# EAGLE board step400_r1 (EAGLE 9.6.2), part 1 of 2
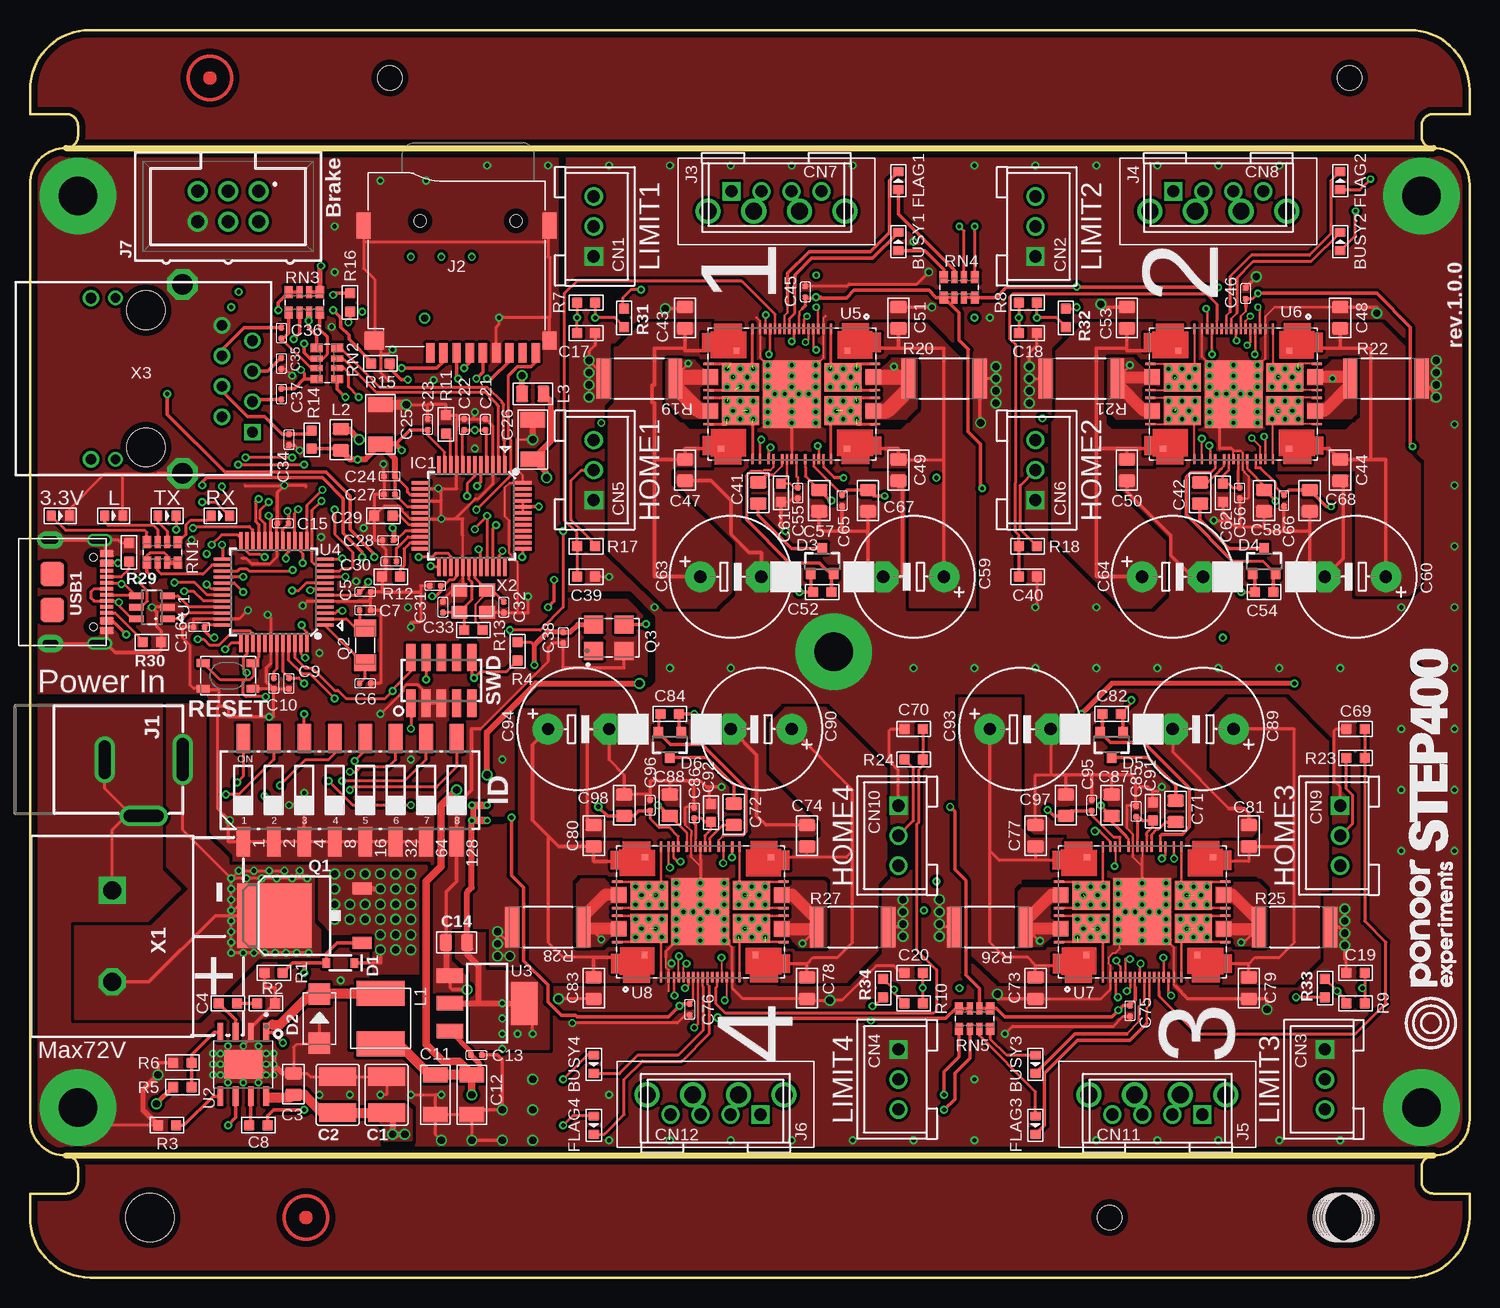
[diagram p3: board, top side]
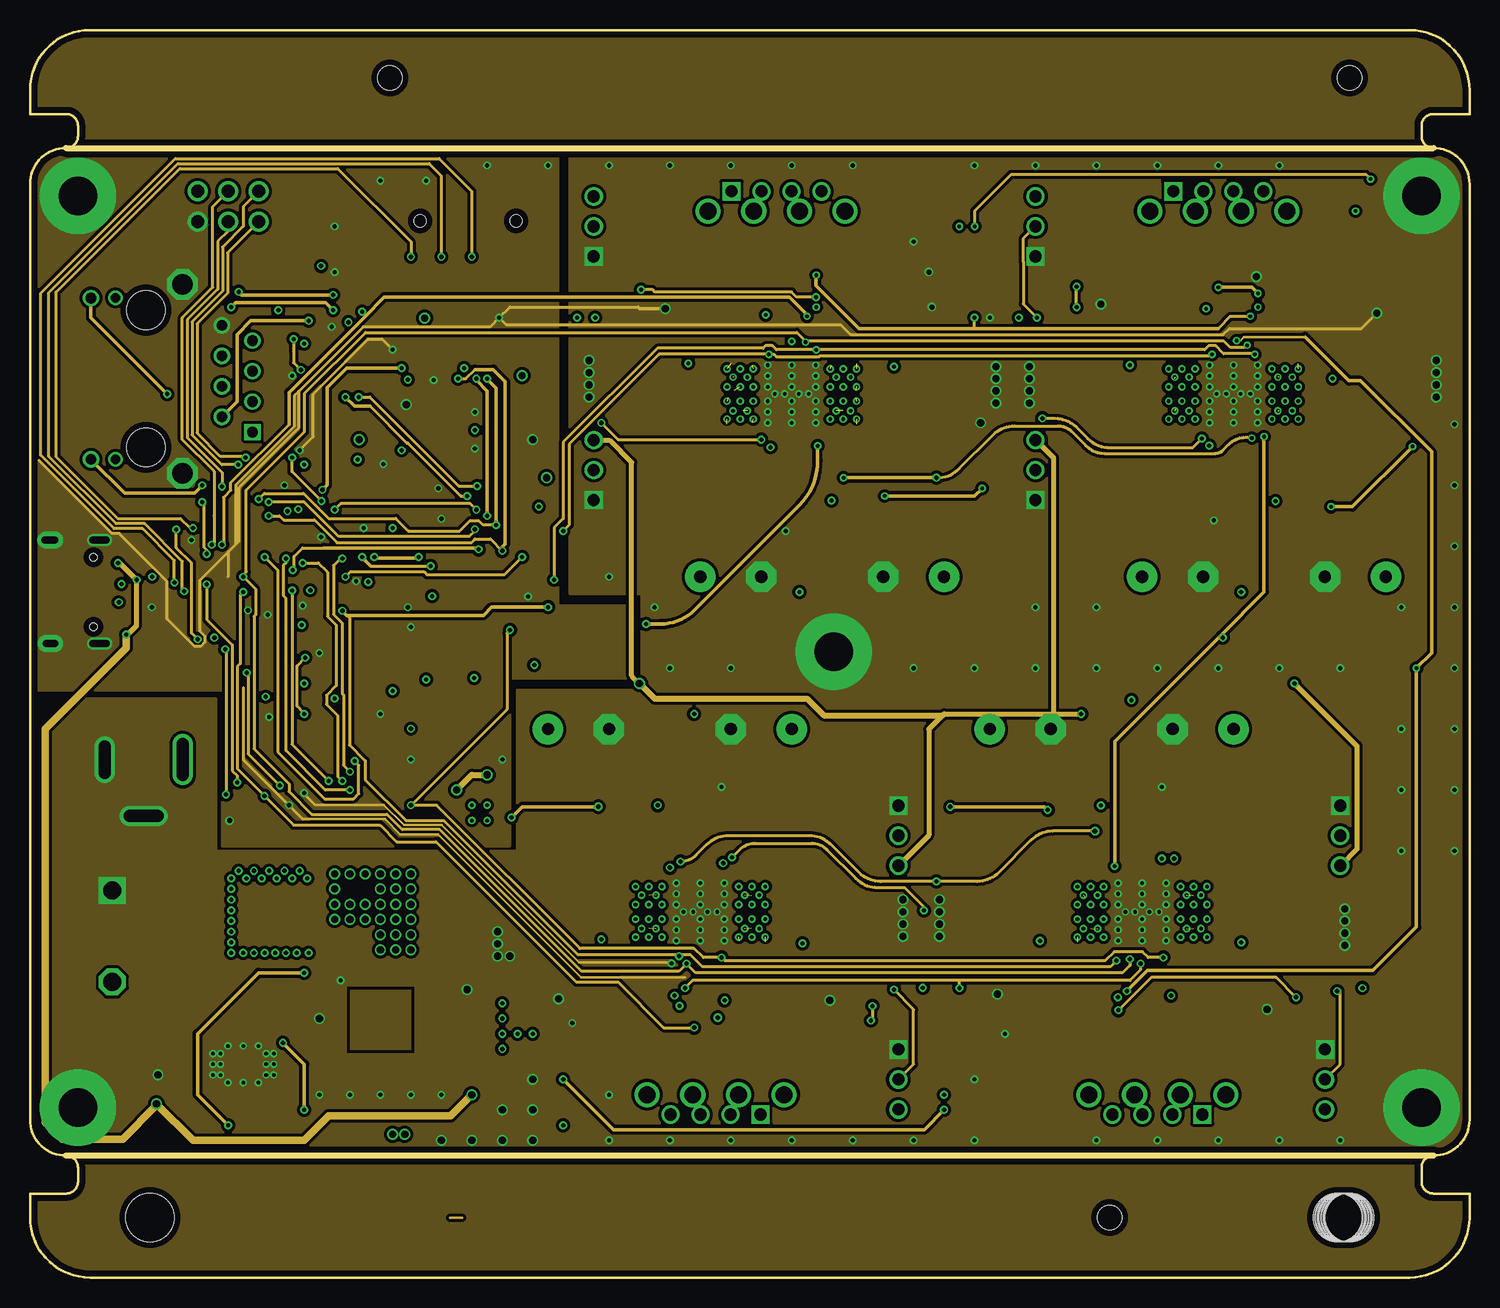
[diagram p4: board, inner layer Route2]
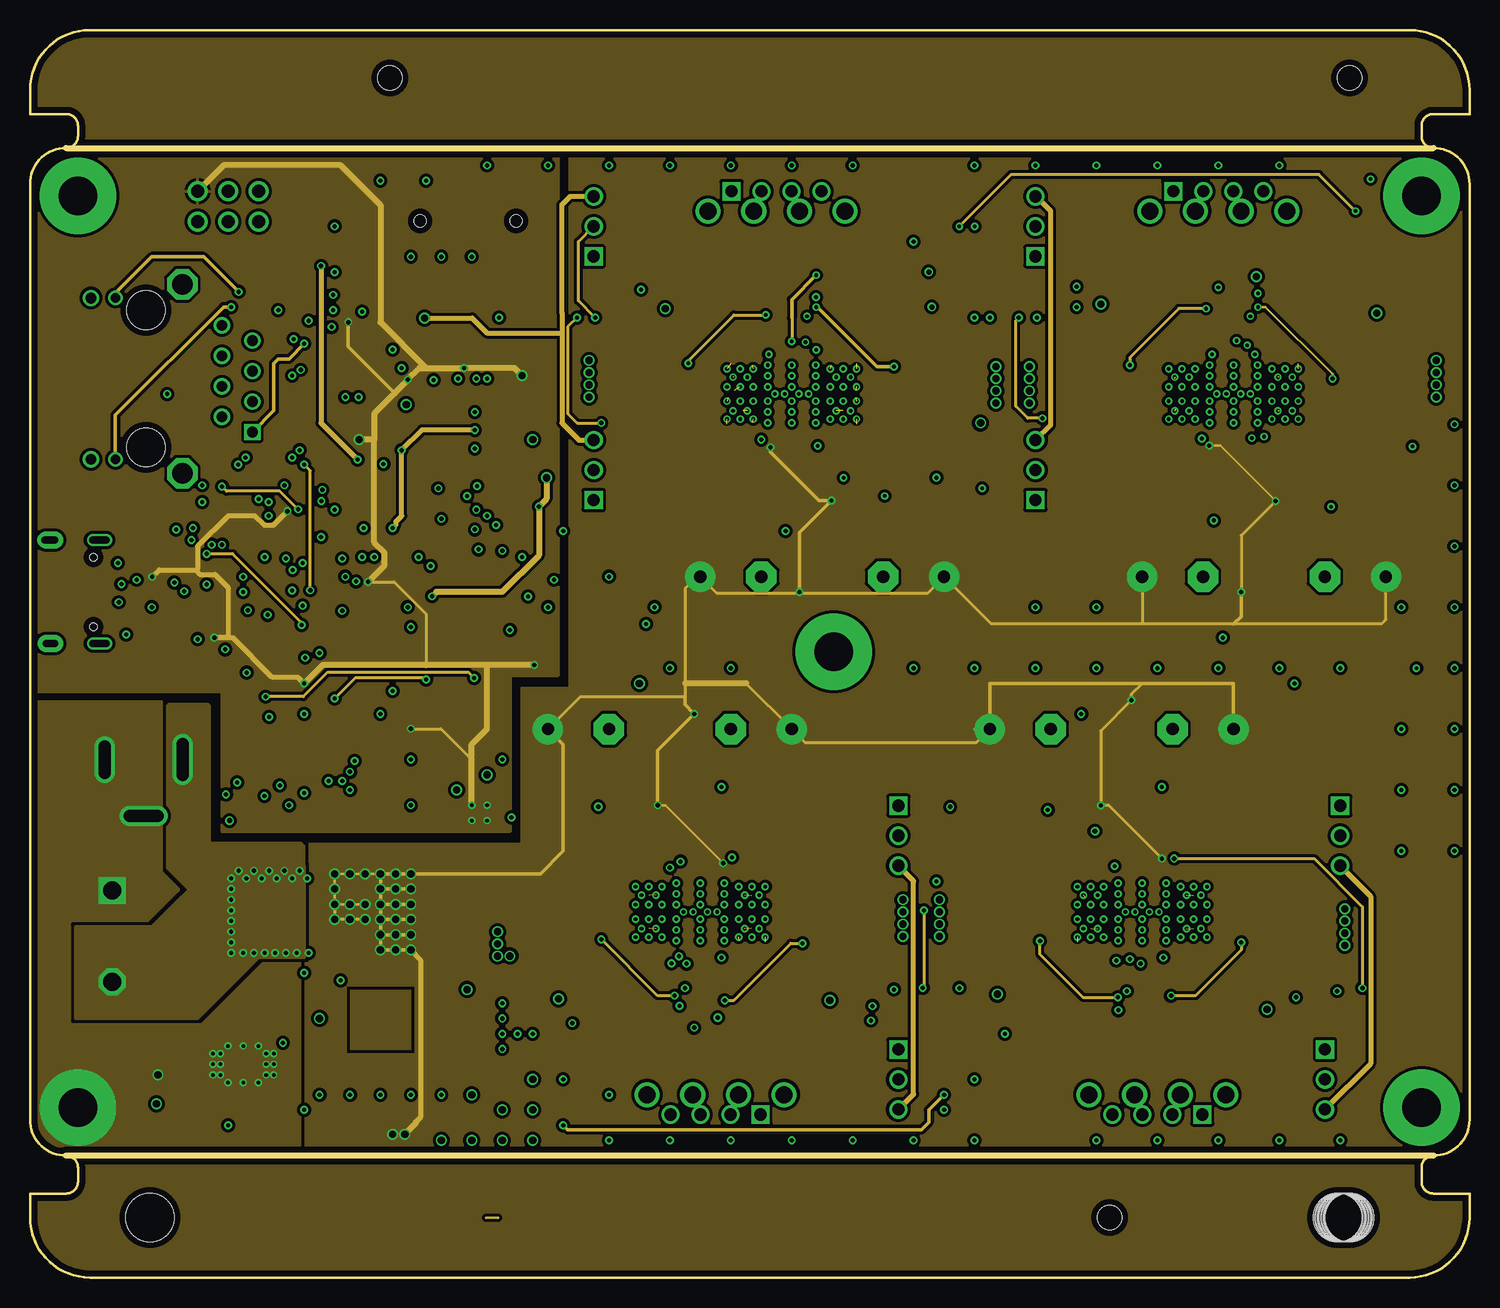
[diagram p5: board, inner layer Route15]
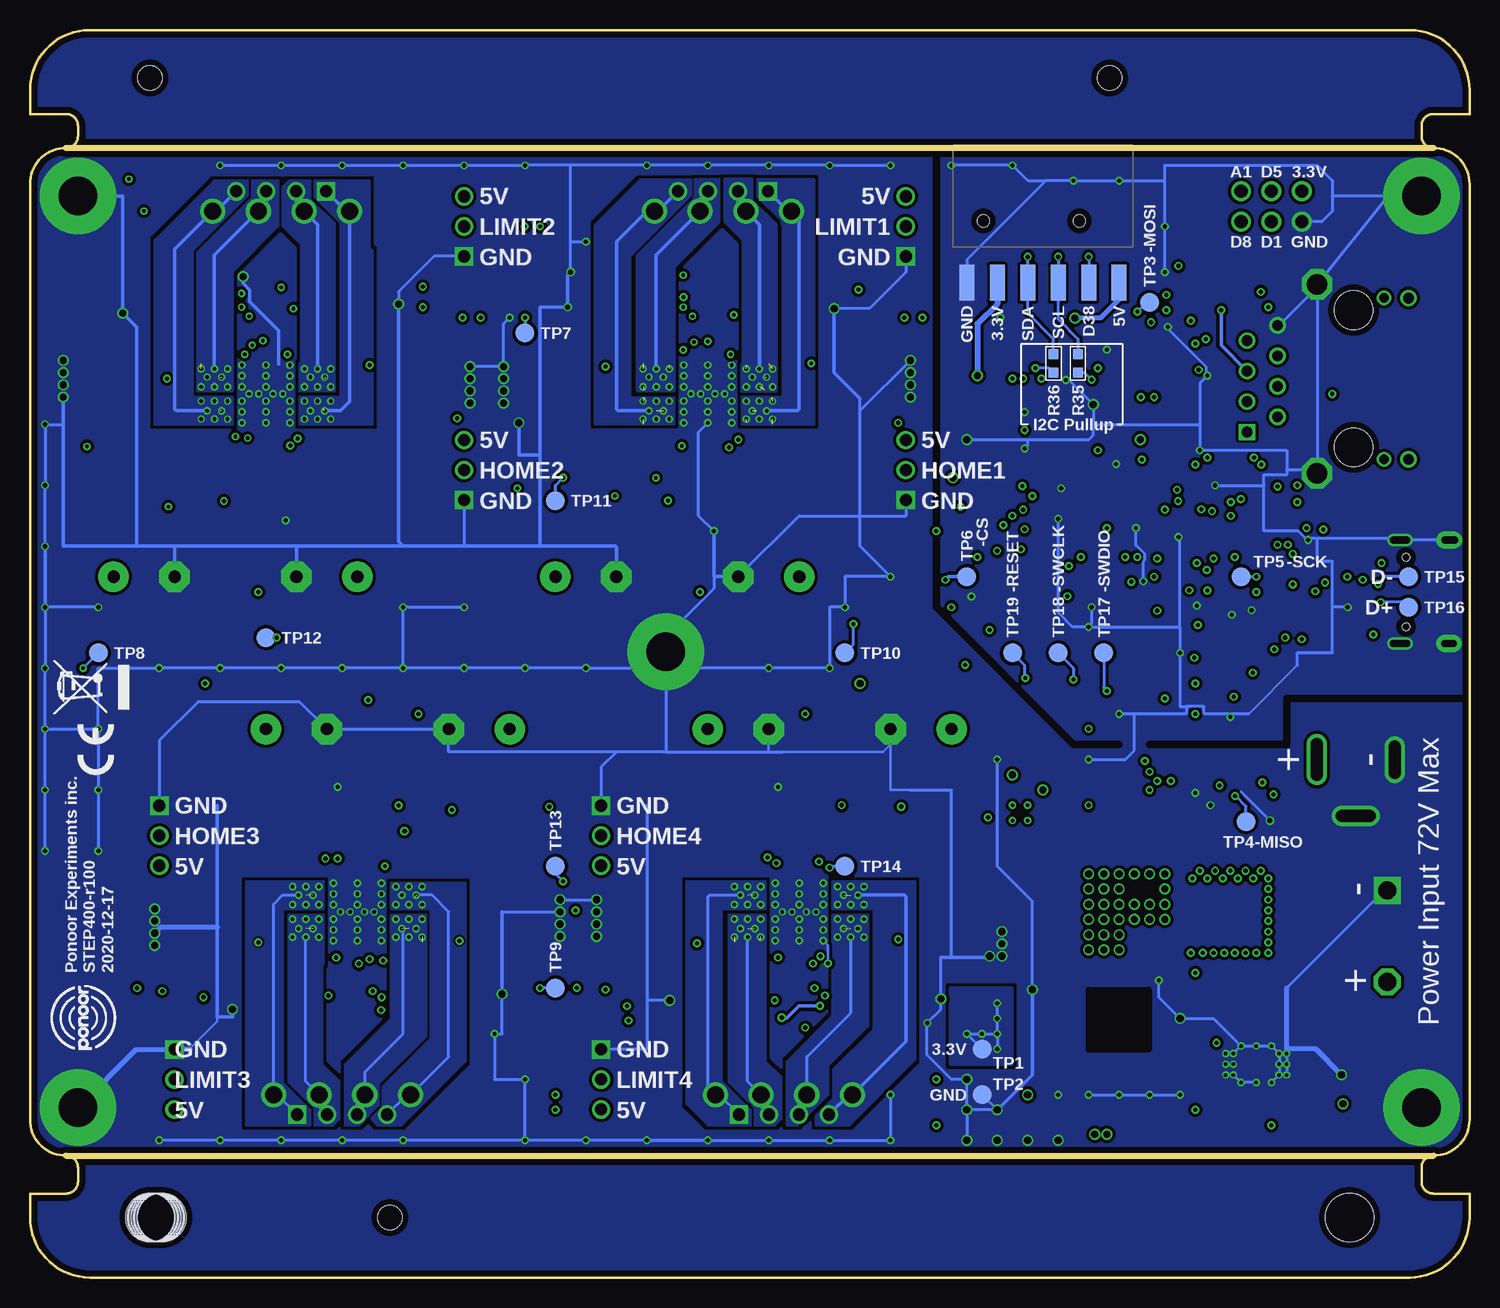
[diagram p6: board, bottom side, seen from below]

Size 120 x 104 mm. Coordinates in mm from the lower left corner, seen from the top.
Outline: 3,94.16 117,94.16
Outline: 117,10.16 3,10.16
Outline: 3,10.16 arc-90 0,13.16 0,91.16 arc-90 3,94.16
Outline: 117,10.16 arc90 120,13.16 120,91.16 arc90 117,94.16
Outline: 117,10.16 arc90 116,9.16 116,8 arc90 117,7 120,7 120,5 arc-90 115,0 5,0 arc-90 0,5 0,7 3,7 arc90 4,8 4,9.16 arc90 3,10.16
Outline: 3,94.16 arc90 4,95.16 4,96 arc90 3,97 0,97 0,99 arc-90 5,104 115,104 arc-90 120,99 120,97 117,97 arc90 116,96 116,95.16 arc90 117,94.16
Copper layers (1+2*15+16): Top 0.035mm / dielectric 1.6mm / Route2 0.035mm / dielectric 1.2mm / Route15 0.035mm / dielectric 0.2mm / Bottom 0.035mm
Design rules "PcbGoGo_4-layer_PCB_eagle_rule *": minimum track width 6mil, minimum drill 12mil, track to track 6mil, track to pad 6mil, pad to pad 6mil, via to via 8mil, smd to smd 0mil, copper to edge 20mil, drill to drill 10mil, minimum pad ring 6mil, minimum via ring 6mil, stop-mask expansion 2mil, vias tented up to drill 100mil, thermal gap 10mil
Holes 2.05 mm at 110,100 90,5 30,100
Holes 4 mm at 10,5 109,5 109.1,5 109.2,5 109.3,5 109.4,5 109.4,5 109.5,5 109.6,5 109.7,5 109.8,5 109.9,5 110,5
tRestrict: area 26.7,19.1 to 31.8,24.1; area 44.3,82.3 to 44.5,94.1; 6 lines
bRestrict: area 26.7,19 to 31.7,24; 6 lines
vRestrict: area 27.9,19.1 to 33,24.1

## Footprints (pad centres in the part's own frame; a part is rotated, then mirrored left to right if it is on the bottom)
LED-0603 = smd 0.762 x 0.889: + -0.762,0; - 0.762,0
C1210 = smd 1.55 x 3.1: 1 -1.5,0; 2 1.5,0
C0805 = smd 1.397 x 1.016: 1 0,0.889; 2 0,-0.889
C0603 = smd 0.889 x 0.889: 1 0,0.762; 2 0,-0.762
C0402 = smd 0.5 x 0.5: 1 0,0.463; 2 0,-0.463
C1206 = smd 1.27 x 2.032: 1 -1.651,0; 2 1.651,0
E5-10,5 = drill 1.016 pad 2.54: + -2.54,0 | drill 1.016 pad 2.54 octagon: - 2.54,0
B3B-XASK-1 = drill 1.016 square: 1 -2.5,0 | drill 1.016: 2 0,0; 3 2.5,0
B4B-XASK-1 = drill 1.016 square: 1 -3.75,0 | drill 1.016: 2 -1.25,0; 3 1.25,0; 4 3.75,0
SOD-323 = smd 0.63 x 0.83: A 1.15,0; C -1.15,0
DO-214AC = smd 1.8 x 1.77: 1 -2.042,0; 2 2.042,0
SOT23-3 = smd 0.8 x 0.9: 1 -0.95,-1; 2 0.95,-1; 3 0,1.1
TQFP48-LONG = smd 1.5 x 0.28: 1 -4.25,2.75; 2 -4.25,2.25; 3 -4.25,1.75; 4 -4.25,1.25; 5 -4.25,0.75; 6 -4.25,0.25; 7 -4.25,-0.25; 8 -4.25,-0.75; 9 -4.25,-1.25; 10 -4.25,-1.75; 11 -4.25,-2.25; 12 -4.25,-2.75; 25 4.25,-2.75; 26 4.25,-2.25; 27 4.25,-1.75; 28 4.25,-1.25; 29 4.25,-0.75; 30 4.25,-0.25; 31 4.25,0.25; 32 4.25,0.75; 33 4.25,1.25; 34 4.25,1.75; 35 4.25,2.25; 36 4.25,2.75 | smd 0.28 x 1.5: 13 -2.75,-4.25; 14 -2.25,-4.25; 15 -1.75,-4.25; 16 -1.25,-4.25; 17 -0.75,-4.25; 18 -0.25,-4.25; 19 0.25,-4.25; 20 0.75,-4.25; 21 1.25,-4.25; 22 1.75,-4.25; 23 2.25,-4.25; 24 2.75,-4.25; 37 2.75,4.25; 38 2.25,4.25; 39 1.75,4.25; 40 1.25,4.25; 41 0.75,4.25; 42 0.25,4.25; 43 -0.25,4.25; 44 -0.75,4.25; 45 -1.25,4.25; 46 -1.75,4.25; 47 -2.25,4.25; 48 -2.75,4.25
CTS-219-08 = smd 1.13 x 2.44: 1 -8.89,-4.3; 2 -6.35,-4.3; 3 -3.81,-4.3; 4 -1.27,-4.3; 5 1.27,-4.3; 6 3.81,-4.3; 7 6.35,-4.3; 8 8.89,-4.3; 9 8.89,4.3; 10 6.35,4.3; 11 3.81,4.3; 12 1.27,4.3; 13 -1.27,4.3; 14 -3.81,4.3; 15 -6.35,4.3; 16 -8.89,4.3
POWERJACK_SLOT = drill 1 pad 1.676: P$2 14,1.3; P$3 14,1.2; P$4 14,1.1; P$5 14,1; P$6 14,0.9; P$7 14,0.8; P$8 14,0.7; P$9 14,0.6; P$10 14,0.5; P$11 14,0.4; P$12 14,0.3; P$13 14,0.2; P$14 14,0.1; P$15 14,0; P$16 14,-0.1; P$17 14,-0.2; P$18 14,-0.3; P$19 14,-0.4; P$20 14,-0.5; P$21 14,-0.6; P$22 14,-0.7; P$23 14,-0.8; P$24 14,-0.9; P$25 14,-1; P$26 14,-1.1; P$27 14,-1.2; P$28 14,-1.3; P$33 11.9,-4.7; P$34 11.8,-4.7; P$35 11.7,-4.7; P$36 11.6,-4.7; P$37 11.5,-4.7; P$38 11.4,-4.7; P$39 11.3,-4.7; P$41 11.1,-4.7; P$42 11,-4.7; P$43 10.9,-4.7; P$44 10.8,-4.7; P$45 10.7,-4.7; P$46 10.6,-4.7; P$47 10.5,-4.7; P$48 10.4,-4.7; P$49 10.3,-4.7; P$50 10.2,-4.7; P$52 10,-4.7; P$53 9.9,-4.7; P$54 9.8,-4.7; P$56 9.6,-4.7; P$63 7.5,1.1; P$64 7.5,1; P$65 7.5,0.9; P$66 7.5,0.8; P$67 7.5,0.7; P$68 7.5,0.6; P$69 7.5,0.5; P$70 7.5,0.4; P$71 7.5,0.3; P$72 7.5,0.2; P$73 7.5,0.1; P$74 7.5,0; P$75 7.5,-0.1; P$76 7.5,-0.2; P$77 7.5,-0.3; P$78 7.5,-0.4; P$79 7.5,-0.5; P$80 7.5,-0.6; P$81 7.5,-0.7; P$82 7.5,-0.8; P$83 7.5,-0.9; P$84 7.5,-1; P$85 7.5,-1.1 | drill 1: P$40 11.2,-4.7; P$51 10.1,-4.7; P$55 9.7,-4.7
TF-115K = smd 0.7 x 1.6: 1 2.2,0; 2 1.1,0; 3 0,0; 4 -1.1,0; 5 -2.2,0; 6 -3.3,0; 7 -4.4,0; 8 -5.5,0; CD -6.6,0 | smd 1.6 x 1.5: SHIELD1 6.85,-1 | smd 1.2 x 2.2: SHIELD2 7.75,-10.6; SHIELD4 -7.75,-10.6 | smd 1.2 x 1.5: SHIELD3 -7.75,-1 | hole 1: -4.95,-11; 3.05,-11
691321300004 = drill 1.4: 1 -5.715,0; 2 -1.905,0; 3 1.905,0; 4 5.715,0
61200621621 = drill 1.1: 1 -2.54,-1.27; 2 -2.54,1.27; 3 0,-1.27; 4 0,1.27; 5 2.54,-1.27; 6 2.54,1.27
1X06-SMD-FEMALE = smd 1.25 x 3: 1 6.35,3.425; 2 3.81,3.425; 3 1.27,3.425; 4 -1.27,3.425; 5 -3.81,3.425; 6 -6.35,3.425
L5045_L = smd 2.1 x 4: P$1 -2.1,0; P$2 2.1,0
L0805 = smd 1.016 x 1.397: 1 -0.889,0; 2 0.889,0
D-PAK_TO252AA = smd 1 x 1.6: 1 -2.28,-4.8; 3 2.28,-4.8 | smd 5.4 x 6.2: 4 0,2.5
FC-135 = smd 1.4 x 1.8: P$1 -1.45,0; P$2 1.45,0
SG5032 = smd 1.5 x 1.6: 1 -1.1,1.27; 2 -1.1,-1.27; 3 1.1,-1.27; 4 1.1,1.27
R0603 = smd 0.889 x 0.889: 1 0,0.762; 2 0,-0.762
RESC6332X71N = smd 1.194 x 3.353: 1 -2.972,0; 2 2.972,0
SKRP = smd 1.05 x 0.65: P$1 -2.075,1.075; P$2 2.075,1.075; P$3 -2.075,-1.075; P$4 2.075,-1.075
CAY16_LONG_W = smd 0.7 x 1: 1 -1.3,-0.85; 4 1.3,-0.85; 5 1.3,0.85; 8 -1.3,0.85 | smd 0.5 x 1: 2 -0.4,-0.85; 3 0.4,-0.85; 6 0.4,0.85; 7 -0.4,0.85
STANDOFF-ELECTRICAL = drill 3.2 pad 6.35: P1 0,0
20021121-00010C4LF = smd 0.762 x 2.286: P$1 -2.54,-1.905; P$2 -2.54,1.905; P$3 -1.27,-1.905; P$4 -1.27,1.905; P$5 0,-1.905; P$6 0,1.905; P$7 1.27,-1.905; P$8 1.27,1.905; P$9 2.54,-1.905; P$10 2.54,1.905
TESTPOINT_D1.6 = smd 1.6 x 1.6: 1 0,0
SOT23-6L = smd 0.55 x 1.2: 1 -0.95,-1.3; 2 0,-1.3; 3 0.95,-1.3; 4 0.95,1.3; 5 0,1.3; 6 -0.95,1.3
SOIC127P600X100-9N = smd 1.61 x 0.58: 1 -2.655,1.905; 2 -2.655,0.635; 3 -2.655,-0.635; 4 -2.655,-1.905; 5 2.655,-1.905; 6 2.655,-0.635; 7 2.655,0.635; 8 2.655,1.905 | smd 2.4 x 3.2: 9 0,0
SOT223 = smd 1.219 x 2.235: 1 -2.311,-3.099; 2 0,-3.099; 3 2.311,-3.099 | smd 3.6 x 2.2: 4 0,3.099
TQFP-48 = smd 1.5 x 0.28: 1 -4.25,2.75; 2 -4.25,2.25; 3 -4.25,1.75; 4 -4.25,1.25; 5 -4.25,0.75; 6 -4.25,0.25; 7 -4.25,-0.25; 8 -4.25,-0.75; 9 -4.25,-1.25; 10 -4.25,-1.75; 11 -4.25,-2.25; 12 -4.25,-2.75; 25 4.25,-2.75; 26 4.25,-2.25; 27 4.25,-1.75; 28 4.25,-1.25; 29 4.25,-0.75; 30 4.25,-0.25; 31 4.25,0.25; 32 4.25,0.75; 33 4.25,1.25; 34 4.25,1.75; 35 4.25,2.25; 36 4.25,2.75 | smd 0.28 x 1.5: 13 -2.75,-4.25; 14 -2.25,-4.25; 15 -1.75,-4.25; 16 -1.25,-4.25; 17 -0.75,-4.25; 18 -0.25,-4.25; 19 0.25,-4.25; 20 0.75,-4.25; 21 1.25,-4.25; 22 1.75,-4.25; 23 2.25,-4.25; 24 2.75,-4.25; 37 2.75,4.25; 38 2.25,4.25; 39 1.75,4.25; 40 1.25,4.25; 41 0.75,4.25; 42 0.25,4.25; 43 -0.25,4.25; 44 -0.75,4.25; 45 -1.25,4.25; 46 -1.75,4.25; 47 -2.25,4.25; 48 -2.75,4.25
IC_POWERSTEP01_VIA = smd 0.5 x 0.5: 1 -3.6,4.65; 23 -3.6,-4.6; 43 4.55,-5.9; 66 4.55,4.6 | smd 0.86 x 0.19: 7 -5.435,3.27; 8 -5.435,2.65; 9 -5.435,2.2; 10 -5.435,1.8; 11 -5.435,1.4; 12 -5.435,1; 13 -5.435,0.6; 14 -5.435,0.2; 15 -5.435,-0.2; 16 -5.435,-0.6; 17 -5.435,-1; 18 -5.435,-1.4; 19 -5.435,-1.8; 20 -5.435,-2.2; 21 -5.435,-2.65; 22 -5.435,-3.27; 53 5.435,-3.27; 54 5.435,-2.65; 55 5.435,-1.93; 56 5.435,-1.53; 57 5.435,-0.8; 58 5.435,-0.4; 59 5.435,0; 60 5.435,0.4; 61 5.435,1.13; 62 5.435,1.85; 63 5.435,2.25; 64 5.435,2.65; 65 5.435,3.27 | smd 0.19 x 0.86: 33 -2.51,-6.935; 37 -0.32,-6.935; 38 0.32,-6.935; 42 2.51,-6.935; 76 2.51,6.935; 80 0.32,6.935; 81 -0.32,6.935; 85 -2.51,6.935 | smd 1.26 x 1.3: 34 -1.42,-6.79; 39 1.42,-6.79; 77 1.42,6.79; 82 -1.42,6.79 | smd 2.4 x 3.1: EPAD3 -1.38,-4.26; EPAD4 1.38,-4.26; EPAD7 1.38,4.26; EPAD8 -1.38,4.27 | drill 0.3: EPAD3_VIA1 -2.1,-3.2; EPAD3_VIA2 -0.6,-3.2; EPAD3_VIA3 -1.4,-3.7; EPAD3_VIA4 -2.1,-4.3; EPAD3_VIA5 -0.6,-4.3; EPAD3_VIA6 -1.4,-4.9; EPAD3_VIA7 -2.1,-5.4; EPAD3_VIA8 -0.6,-5.4; EPAD4_VIA1 0.6,-3.2; EPAD4_VIA2 2.1,-3.2; EPAD4_VIA3 1.4,-3.7; EPAD4_VIA4 0.6,-4.3; EPAD4_VIA5 2.1,-4.3; EPAD4_VIA6 1.4,-4.9; EPAD4_VIA7 0.6,-5.4; EPAD4_VIA8 2.1,-5.4; EPAD7_VIA1 0.6,5.4; EPAD7_VIA2 2.1,5.4; EPAD7_VIA3 1.4,4.9; EPAD7_VIA4 0.6,4.3; EPAD7_VIA5 2.1,4.3; EPAD7_VIA6 1.4,3.7; EPAD7_VIA7 0.6,3.2; EPAD7_VIA8 2.1,3.2; EPAD8_VIA1 -2.1,5.4; EPAD8_VIA2 -0.6,5.4; EPAD8_VIA3 -1.4,4.9; EPAD8_VIA4 -2.1,4.3; EPAD8_VIA5 -0.6,4.3; EPAD8_VIA6 -1.4,3.7; EPAD8_VIA7 -2.1,3.2; EPAD8_VIA8 -0.6,3.2; EPAD9_VIA1 -2.4,2; EPAD9_VIA2 -1.5,2; EPAD9_VIA3 -0.6,2; EPAD9_VIA4 0.6,2; EPAD9_VIA5 1.5,2; EPAD9_VIA6 2.4,2; EPAD9_VIA7 -2.4,0; EPAD9_VIA8 -1.5,0; EPAD9_VIA9 -0.6,0; EPAD9_VIA10 0.6,0; EPAD9_VIA11 1.5,0; EPAD9_VIA12 2.4,0; EPAD9_VIA13 -2.4,-2; EPAD9_VIA14 -1.5,-2; EPAD9_VIA15 -0.6,-2; EPAD9_VIA16 0.6,-2; EPAD9_VIA17 1.5,-2; EPAD9_VIA18 2.4,-2; EPAD9_VIA19 0,0.6; EPAD9_VIA20 0,1.4; EPAD9_VIA21 0,-0.6; EPAD9_VIA22 0,-1.4 | smd 5.6 x 4.8: EPAD9 0.04,0
USB-C_USB2.0-TYPE-C = smd 1.2 x 0.6: A1_B12 0.05,3.2; A4_B9 0.05,2.4; B1_A12 0.05,-3.2; B4_A9 0.05,-2.4 | smd 1.2 x 0.3: A5 0.05,1.25; A6 0.05,0.25; A7 0.05,-0.25; A8 0.05,-1.25; B5 0.05,-1.75; B6 0.05,-0.75; B7 0.05,0.75; B8 0.05,1.75 | smd 2 x 2: S5 -4.5,1.5; S6 -4.5,-1.5 | drill 0.6 pad 1.27: S7 -5.1,4.32 | drill 0.6 pad 1.422: S8 -5,4.32; S9 -4.9,4.32; S10 -4.8,4.32; S11 -4.7,4.32; S12 -4.6,4.32; S13 -4.5,4.32; S14 -4.4,4.32; S15 -4.3,4.32; S29 -5,-4.3; S30 -4.9,-4.3; S31 -4.8,-4.3; S32 -4.7,-4.3; S33 -4.6,-4.3; S34 -4.5,-4.3; S35 -4.4,-4.3; S36 -4.3,-4.3 | drill 0.6 pad 1: S16 -1.1,4.32; S17 -1,4.32; S18 -0.9,4.32; S19 -0.8,4.32; S20 -0.7,4.32; S21 -0.6,4.32; S22 -0.5,4.32; S23 -0.4,4.32; S24 -0.3,4.32; S25 -0.2,4.32; S26 -0.1,4.32; S27 0,4.32; S37 -1.1,-4.3; S38 -1,-4.3; S39 -0.9,-4.3; S40 -0.8,-4.3; S41 -0.7,-4.3; S42 -0.6,-4.3; S43 -0.5,-4.3; S44 -0.4,-4.3; S45 -0.3,-4.3; S46 -0.2,-4.3; S47 -0.1,-4.3; S48 0,-4.3 | hole 0.6: -1.05,-2.89; -1.05,2.89
WJ25C-B-7.62-2P = drill 1.5 square: P$1 -3.81,0 | drill 1.5 octagon: P$2 3.81,0
CRYSTAL-3.2-2.5 = smd 1.3 x 1.05: 1 -1.15,-0.925; 2 1.15,-0.925; 3 1.15,0.925; 4 -1.15,0.925
HR871181A = drill 0.9 square: 1 -4.44,-8.89 | drill 0.9: 2 -3.175,-6.35; 3 -1.905,-8.89; 4 -0.635,-6.35; 5 0.635,-8.89; 6 1.905,-6.35; 7 3.175,-8.89; 8 4.445,-6.35; 10 -6.725,4.57; 12 6.725,4.57 | drill 0.8: 9 -6.725,2.54; 11 6.725,2.54 | drill 1.7 octagon: SHIELD1 -7.875,-3.05; SHIELD2 7.875,-3.05 | hole 3.2: -5.715,0; 5.715,0

## Placement (x,y rotation side)
3.3V  GREEN-0603  [LED-0603]  2.54,63.5 0 top
BUSY1  GREEN-0603  [LED-0603]  72.39,86.36 90 top
BUSY2  GREEN-0603  [LED-0603]  109.22,86.36 90 top
BUSY3  GREEN-0603  [LED-0603]  83.82,17.78 270 top
BUSY4  GREEN-0603  [LED-0603]  46.99,17.78 270 top
C1  4.7uF/100V  [C1210]  29.72,15.24 90 top
C2  4.7uF/100V  [C1210]  25.65,15.24 90 top
C3  100nF/100V  [C0805]  21.97,16.13 0 top
C4  100nf  [C0603]  16.51,22.86 270 top
C5  100nf  [C0402]  27.94,57.15 90 top
C6  22pF  [C0402]  27.94,49.53 270 top
C7  22pF  [C0402]  27.94,55.63 90 top
C8  100nf  [C0603]  19.05,12.7 90 top
C9  100nf  [C0402]  21.59,49.53 0 top
C10  100nf  [C0402]  20.32,49.53 0 top
C11  47uF  [C1206]  33.78,15.24 90 top
C12  47uF  [C1206]  36.83,15.24 90 top
C13  100nf  [C0402]  37.21,18.54 90 top
C14  10uF/10V  [C0805]  35.56,27.94 90 top
C15  100nf  [C0402]  21.08,62.87 270 top
C16  100nf  [C0402]  14.1,54.23 270 top
C17  1uf  [C0603]  46.35,78.74 270 top
C18  1uf  [C0603]  83.19,78.74 270 top
C19  1uf  [C0603]  110.49,25.4 90 top
C20  1uf  [C0603]  73.66,25.4 90 top
C21  100nf  [C0402]  37.97,71.12 180 top
C22  100nf  [C0402]  36.2,71.12 180 top
C23  100nf  [C0402]  33.15,71.12 180 top
C24  100nf  [C0402]  29.97,66.8 270 top
C25  47uF/6.3V  [C1206]  29.21,71.12 90 top
C26  47uF/6.3V  [C1206]  41.91,69.85 90 top
C27  100nf  [C0402]  29.97,65.28 270 top
C28  100nf  [C0402]  29.84,61.47 270 top
C29  4.7uF/6.3V  [C0603]  29.46,63.5 90 top
C30  10nf  [C0402]  30.1,59.69 90 top
C31  100nf  [C0402]  33.78,57.66 90 top
C32  22pF  [C0402]  39.5,55.88 0 top
C33  22pF  [C0402]  34.42,55.88 180 top
C34  22NF 50V  [C0402]  21.59,69.85 0 top
C35  10nf  [C0402]  20.95,76.2 0 top
C36  6.8nF  [C0402]  20.95,78.74 180 top
C37  6.8nF  [C0402]  20.95,73.66 0 top
C38  100nf  [C0402]  44.45,53.34 180 top
C39  1uf  [C0603]  46.35,58.42 270 top
C40  1uf  [C0603]  83.19,58.42 270 top
C41  47nF  [C0805]  60.71,65.41 0 top
C42  47nF  [C0805]  97.54,65.41 0 top
C43  220nF  [C0805]  54.61,80.01 0 top
C44  220nF  [C0805]  109.22,67.31 180 top
C45  100nf  [C0402]  64.64,82.17 180 top
C46  100nf  [C0402]  101.35,82.04 180 top
C47  220nF  [C0805]  54.61,67.31 180 top
C48  220nF  [C0805]  109.22,80.01 0 top
C49  220nF  [C0805]  72.39,67.31 180 top
C50  220nF  [C0805]  91.44,67.31 180 top
C51  220nF  [C0805]  72.39,80.01 0 top
C52  470nF  [C0603]  66.04,57.15 270 top
C53  220nF  [C0805]  91.44,80.01 0 top
C54  470nF  [C0603]  102.87,57.15 270 top
C55  100nf  [C0402]  64.01,65.41 0 top
C56  100nf  [C0402]  100.84,65.41 0 top
C57  100nF/100V  [C0805]  65.79,64.77 180 top
C58  100nF/100V  [C0805]  102.87,64.77 180 top
C59  100uF  [E5-10,5]  73.66,58.42 180 top
C60  100uF  [E5-10,5]  110.49,58.42 180 top
C61  470nF  [C0603]  62.61,65.41 180 top
C62  470nF  [C0603]  99.44,65.41 180 top
C63  100uF  [E5-10,5]  58.42,58.42 0 top
C64  100uF  [E5-10,5]  95.25,58.42 0 top
C65  220nF  [C0402]  67.69,64.77 180 top
C66  220nF  [C0402]  104.52,64.77 180 top
C67  22uf  [C0805]  69.85,64.77 180 top
C68  22uf  [C0805]  106.68,64.77 180 top
C69  1uf  [C0603]  110.49,45.72 90 top
C70  1uf  [C0603]  73.66,45.72 90 top
C71  47nF  [C0805]  95.5,38.86 180 top
C72  47nF  [C0805]  58.67,38.61 180 top
C73  220nF  [C0805]  83.82,24.13 180 top
C74  220nF  [C0805]  64.77,36.83 0 top
C75  100nf  [C0402]  91.69,22.23 0 top
C76  100nf  [C0402]  54.99,22.35 0 top
C77  220nF  [C0805]  83.82,36.83 0 top
C78  220nF  [C0805]  64.77,24.13 180 top
C79  220nF  [C0805]  101.6,24.13 180 top
C80  220nF  [C0805]  46.99,36.83 0 top
C81  220nF  [C0805]  101.6,36.83 0 top
C82  470nF  [C0603]  90.17,46.99 90 top
C83  220nF  [C0805]  46.99,24.13 180 top
C84  470nF  [C0603]  53.34,46.99 90 top
C85  100nf  [C0402]  92.2,38.86 180 top
C86  100nf  [C0402]  55.37,38.73 180 top
C87  100nF/100V  [C0805]  90.17,39.37 0 top
C88  100nF/100V  [C0805]  53.34,39.37 0 top
C89  100uF  [E5-10,5]  97.79,45.72 180 top
C90  100uF  [E5-10,5]  60.96,45.72 180 top
C91  470nF  [C0603]  93.6,38.86 0 top
C92  470nF  [C0603]  56.77,38.73 0 top
C93  100uF  [E5-10,5]  82.55,45.72 0 top
C94  100uF  [E5-10,5]  45.72,45.72 0 top
C95  220nF  [C0402]  88.52,39.37 0 top
C96  220nF  [C0402]  51.69,39.37 0 top
C97  22uf  [C0805]  86.36,39.37 0 top
C98  22uf  [C0805]  49.53,39.37 0 top
CN1  [B3B-XASK-1]  46.99,87.63 90 top
CN2  [B3B-XASK-1]  83.82,87.63 90 top
CN3  [B3B-XASK-1]  107.95,16.51 270 top
CN4  [B3B-XASK-1]  72.39,16.51 270 top
CN5  [B3B-XASK-1]  46.99,67.31 90 top
CN6  [B3B-XASK-1]  83.82,67.31 90 top
CN7  [B4B-XASK-1]  62.23,90.55 0 top
CN8  [B4B-XASK-1]  99.06,90.55 0 top
CN9  [B3B-XASK-1]  109.22,36.83 270 top
CN10  [B3B-XASK-1]  72.39,36.83 270 top
CN11  [B4B-XASK-1]  93.98,13.59 180 top
CN12  [B4B-XASK-1]  57.15,13.59 180 top
D1  5.1V  [SOD-323]  25.88,26.21 180 top
D2  100V 2A  [DO-214AC]  24.13,21.59 90 top
D3  BAR43  [SOT23-3]  66.04,59.69 0 top
D4  BAR43  [SOT23-3]  102.87,59.69 0 top
D5  BAR43  [SOT23-3]  90.17,44.45 180 top
D6  BAR43  [SOT23-3]  53.34,44.45 180 top
FLAG1  YELLOW-0603  [LED-0603]  72.39,91.44 90 top
FLAG2  YELLOW-0603  [LED-0603]  109.22,91.44 90 top
FLAG3  YELLOW-0603  [LED-0603]  83.82,12.7 270 top
FLAG4  YELLOW-0603  [LED-0603]  46.99,12.7 270 top
IC1  0982_W5500LONG  [TQFP48-LONG]  36.83,63.5 270 top
ID  219-08  [CTS-219-08]  26.67,40.64 0 top
J1  POWERJACK  [POWERJACK_SLOT]  -1.27,43.18 0 top
J2  SDCARD_SLOT_TF-115K  [TF-115K]  35.56,77.09 180 top
J3  691321300004  [691321300004]  62.23,88.9 0 top
J4  691321300004  [691321300004]  99.06,88.9 0 top
J5  691321300004  [691321300004]  93.98,15.24 180 top
J6  691321300004  [691321300004]  57.15,15.24 180 top
J7  [61200621621]  16.51,89.28 180 top
J8  CONN_06_SMD_FEMALE  [1X06-SMD-FEMALE]  35.56,86.36 180 bottom
L  BLUE-0603  [LED-0603]  6.99,63.5 0 top
L1  150uH  [L5045_L]  29.21,21.59 270 top
L2  330R-1500MA  [L0805]  25.91,69.85 270 top
L3  330R-1500MA  [L0805]  41.91,73.66 0 top
Q1  SUD50P08-25L-E3  [D-PAK_TO252AA]  22.89,30.16 90 top
Q2  32.768kHz  [FC-135]  27.94,52.7 270 top
Q3  16MHz  [SG5032]  48.26,53.34 90 top
R1  100k  [R0603]  20.32,25.4 90 top
R2  4.7k  [R0603]  19.68,22.86 270 top
R3  13k  [R0603]  11.43,12.7 90 top
R4  10K 1/10W  [R0603]  40.64,52.2 180 top
R5  3k  [R0603]  12.7,15.88 270 top
R6  750  [R0603]  12.7,17.91 90 top
R7  100R  [R0603]  46.35,81.28 270 top
R8  100R  [R0603]  83.19,81.28 270 top
R9  100R  [R0603]  110.49,22.86 90 top
R10  100R  [R0603]  73.66,22.86 90 top
R11  12.4K  [R0603]  34.67,71.12 0 top
R12  10K 1/10W  [R0603]  30.1,58.42 90 top
R13  1M 1/10W  [R0603]  36.96,53.98 270 top
R14  10R  [R0603]  23.5,69.85 0 top
R15  330R  [R0603]  29.21,76.2 90 top
R16  330R  [R0603]  26.67,81.28 0 top
R17  100R  [R0603]  46.35,60.96 270 top
R18  100R  [R0603]  83.19,60.96 270 top
R19  0.1  [RESC6332X71N]  50.8,74.93 180 top
R20  0.1  [RESC6332X71N]  76.2,74.93 0 top
R21  0.1  [RESC6332X71N]  87.63,74.93 180 top
R22  0.1  [RESC6332X71N]  113.03,74.93 0 top
R23  100R  [R0603]  110.49,43.31 90 top
R24  100R  [R0603]  73.66,43.18 90 top
R25  0.1  [RESC6332X71N]  105.41,29.21 0 top
R26  0.1  [RESC6332X71N]  80.01,29.21 180 top
R27  0.1  [RESC6332X71N]  68.58,29.21 0 top
R28  0.1  [RESC6332X71N]  43.18,29.21 180 top
R29  5.1k  [R0603]  8.26,60.45 0 top
R30  5.1k  [R0603]  10.16,52.96 90 top
R31  10K 1/10W  [R0603]  49.53,80.01 180 top
R32  10K 1/10W  [R0603]  86.36,80.01 180 top
R33  10K 1/10W  [R0603]  107.95,24.13 0 top
R34  10K 1/10W  [R0603]  71.12,24.13 0 top
R35  4.7K  [R0603]  32.64,76.2 0 bottom
R36  4.7K  [R0603]  34.67,76.2 0 bottom
RESET  SWITCH-SPST-2  [SKRP]  16.51,50.16 0 top
RN1  330  [CAY16_LONG_W]  11.05,60.45 180 top
RN2  33  [CAY16_LONG_W]  24.77,76.2 270 top
RN3  49.9  [CAY16_LONG_W]  22.86,81.28 180 top
RN4  330  [CAY16_LONG_W]  77.47,82.55 0 top
RN5  330  [CAY16_LONG_W]  78.74,21.59 180 top
RX  RED-0603  [LED-0603]  15.88,63.5 0 top
S2  STANDOFF_ELECTRICAL  [STANDOFF-ELECTRICAL]  67,52.16 0 top
S3  STANDOFF_ELECTRICAL  [STANDOFF-ELECTRICAL]  116,90.16 0 top
S4  STANDOFF_ELECTRICAL  [STANDOFF-ELECTRICAL]  116,14.16 0 top
S5  STANDOFF_ELECTRICAL  [STANDOFF-ELECTRICAL]  4,90.16 0 top
S6  STANDOFF_ELECTRICAL  [STANDOFF-ELECTRICAL]  4,14.16 0 top
SWD  CORTEX_DEBUG_SMT  [20021121-00010C4LF]  34.29,49.78 0 top
TP1  TESTPOINT_D1.6  [TESTPOINT_D1.6]  40.64,19.05 0 bottom
TP2  TESTPOINT_D1.6  [TESTPOINT_D1.6]  40.64,15.24 0 bottom
TP3  TESTPOINT_D1.6  [TESTPOINT_D1.6]  26.67,81.28 0 bottom
TP4  TESTPOINT_D1.6  [TESTPOINT_D1.6]  18.64,38.02 0 bottom
TP5  TESTPOINT_D1.6  [TESTPOINT_D1.6]  19.05,58.42 0 bottom
TP6  TESTPOINT_D1.6  [TESTPOINT_D1.6]  41.91,58.42 0 bottom
TP7  TESTPOINT_D1.6  [TESTPOINT_D1.6]  78.74,78.74 0 bottom
TP8  TESTPOINT_D1.6  [TESTPOINT_D1.6]  114.3,52.07 0 bottom
TP9  TESTPOINT_D1.6  [TESTPOINT_D1.6]  76.2,24.13 0 bottom
TP10  TESTPOINT_D1.6  [TESTPOINT_D1.6]  52.07,52.07 0 bottom
TP11  TESTPOINT_D1.6  [TESTPOINT_D1.6]  76.2,64.77 0 bottom
TP12  TESTPOINT_D1.6  [TESTPOINT_D1.6]  100.33,53.34 0 bottom
TP13  TESTPOINT_D1.6  [TESTPOINT_D1.6]  76.2,34.29 0 bottom
TP14  TESTPOINT_D1.6  [TESTPOINT_D1.6]  52.07,34.29 0 bottom
TP15  TESTPOINT_D1.6  [TESTPOINT_D1.6]  5.08,58.42 0 bottom
TP16  TESTPOINT_D1.6  [TESTPOINT_D1.6]  5.08,55.88 0 bottom
TP17  TESTPOINT_D1.6  [TESTPOINT_D1.6]  30.48,52.07 0 bottom
TP18  TESTPOINT_D1.6  [TESTPOINT_D1.6]  34.29,52.07 0 bottom
TP19  TESTPOINT_D1.6  [TESTPOINT_D1.6]  38.1,52.07 0 bottom
TX  YELLOW-0603  [LED-0603]  11.43,63.5 0 top
U1  USBLC6-2SC6  [SOT23-6L]  10.16,55.88 90 top
U2  BD9G341AEFJ  [SOIC127P600X100-9N]  17.78,17.78 270 top
U3  LD1117S33  [SOT223]  38.1,22.86 270 top
U4  ATSAMD21G-A  [TQFP-48]  20.32,57.15 180 top
U5  POWERSTEP01_VIA  [IC_POWERSTEP01_VIA]  63.5,73.66 270 top
U6  POWERSTEP01_VIA  [IC_POWERSTEP01_VIA]  100.33,73.66 270 top
U7  POWERSTEP01_VIA  [IC_POWERSTEP01_VIA]  92.71,30.48 90 top
U8  POWERSTEP01_VIA  [IC_POWERSTEP01_VIA]  55.88,30.48 90 top
U$1  [STEP400_LOGO_6MM]  119.38,19.05 90 top
U$2  [FIDUCIAL_MARKER_PBAN]  23,5 0 top
U$3  [FIDUCIAL_MARKER_PBAN]  15,100 0 top
U$4  [PONOOR_LOGO_6MM]  115.57,21.59 90 bottom
U$6  [WEEE_6MM]  111.76,46.99 90 bottom
U$8  [CE_3MM]  113.03,41.91 90 bottom
USB1  [USB-C_USB2.0-TYPE-C]  6.35,57.15 0 top
X1  CONN_02  [WJ25C-B-7.62-2P]  6.86,28.45 270 top
X2  25MHz  [CRYSTAL-3.2-2.5]  36.96,56.39 0 top
X3  RJ45_MAGNETICS_LED_HR871181A  [HR871181A]  9.65,74.93 90 top

## Tracks (layer width: path | path; a pad name or v marks a point on that pad's centre or on a via)
1V2O
  Top 0.254: C30.2 30.56,60.79 31.52,61.75 IC1.22
3.3V  (via drill 0.3 pad 0.3, 0.35, 0.6)
  Top 0.254: U4.44 21.07,50.51 C9.1 22.4,49.99 v22.86,49.53 | U4.36 14.73,54.4 C16.1 | U4.6 27.23,56.9 C5.1 | RN1.7 11.45,60.18 11.25,60.38 9.96,60.38 9.75,60.17 RN1.5 | U4.17 21.07,62.39 C15.1 | R4.2 41.77,52.96 42.04,52.69 | v41.91,20.32 41.91,22.86 | SWD.P$1 v31.75,45.75
  Top 0.305: C16.1 14.56,53.89 15.11,53.34 v15.37,53.34 | v28.19,57.99 28.19,57.87 28.11,57.78 28.07,57.78 27.77,57.48 27.77,57.44 C5.1 | v10.19,58.42 9.75,58.86 RN1.5 | v21.46,63.88 21.54,63.8 C15.1 | J2.4 36.66,76.28 v36.2,75.82 | R15.2 29.98,75.81 30.94,74.85 v31.5,74.85 | R16.2 26.67,79.76 v26.54,79.63
  Top 0.406: RN1.7 RN1.8 | Q3.4 45.68,54.44 45.04,53.8 C38.2 43.15,53.8 42.04,52.69 v42.04,51.05
  Top 0.508: v36.83,39.37 36.96,39.24 36.96,38.23 v36.83,38.1 36.83,32.51 36.45,32.13 C14.2 36.45,26.92 37.34,26.04 37.34,22.86 | L3.1 v41.02,75.18 | v27.43,69.85 26.54,70.74 L2.1 | U3.2 37.34,22.86 | 37.34,22.86 v39.37,22.86 U3.4 41.91,22.86
  Top 0.61: v38.1,38.1 v36.83,38.1 | v38.1,39.37 v36.83,39.37
  Route15 0.254: v28.19,57.99 30.35,57.99 33.02,55.33 33.02,51.05 | v31.75,45.75 34.26,45.75 36.83,43.18
  Route15 0.305: v26.54,79.63 26.54,77.6 30.42,73.72
  Route15 0.406: v22.86,49.53 22.35,50.04 20.19,50.04 16.89,53.34 v15.37,53.34 16.51,53.34 16.51,57.53 15.43,58.61 14.16,58.61 13.84,58.93 | v21.46,63.88 20.27,62.69 19.55,62.69 18.75,63.5 16.51,63.5 13.97,60.96 13.97,59.05 13.84,58.93 | v10.19,58.42 10.76,58.99 13.78,58.99 13.84,58.93
  Route15 0.508: v42.04,51.05 38.1,51.05 | 38.1,51.05 33.02,51.05 24.38,51.05 v22.86,49.53 | v41.02,75.18 40.39,75.82 v36.2,75.82 33.02,75.82 | v36.83,39.37 36.83,43.18 36.83,44.45 38.1,45.72 38.1,51.05 | 28.7,69.85 28.7,61.28 29.56,60.43 29.56,59.36 v28.19,57.99 | 28.7,69.85 v27.43,69.85 | J7.5 16.13,92.71 25.9,92.71 29.21,89.4 29.21,79.63 33.02,75.82 | 33.02,75.82 32.47,75.82 v31.5,74.85 31.5,74.8 30.42,73.72 28.7,72.01 28.7,69.85
  Bottom 0.254: TP1.1 v41.91,20.32 v40.64,20.32 v39.37,20.32 | v39.37,20.32 v39.37,19.05 | v39.37,20.32 v39.37,21.59 v39.37,22.86 | R35.2 32.09,75.44 v31.5,74.85 | R36.2 35.05,75.82 v36.2,75.82
  Bottom 0.508: J8.2 39.37,81.15 41.02,79.5 v41.02,75.18
  pour Route15 (isolate 0.254, rank 6): -1,94.16 44,94.16 44,56.16 44,50.16 40,50.16 40,37.16 16,37.16 16,48.81 -1,48.81
  pour Top (isolate 0.254, rank 4, no thermals): 35.56,28.7 38.35,28.7 38.23,28.57 38.23,25.78 38.48,26.04 42.93,26.04 43.18,25.78 43.18,19.05 36.83,19.05 36.83,25.4 35.56,26.67
  pour Bottom (isolate 0.254, no thermals): 38.1,24.13 43.31,24.13 43.31,17.78 38.1,17.78
5V  (via drill 0.35, 0.6)
  Top 0.254: U1.5 9.27,55.88 9.78,56.39 9.78,57.28 v8.89,58.17 | v7.33,59.56 7.32,59.55 USB1.A4_B9
  Top 0.305: v8.02,53.61 7.3,54.32 6.88,54.75 USB1.B4_A9
  Top 0.406: R5.2 v10.54,14.48 | v105.41,49.53 90.17,49.53 v87.63,46.99 | U3.3 36.75,18.8 C13.1 37.07,18.22 37.47,17.82 37.47,17.27 37.08,16.89 C12.2
  Top 0.508: v38.1,41.91 38.1,45.45 42.18,49.53 v50.8,49.53
  Top 0.61: v36.83,15.24 C12.2 36.83,17.02 35.81,18.03 34.42,18.03 33.02,19.43 33.02,33.02 34.29,34.29 34.29,39.37 v35.56,40.64
  Top 0.813: C12.2 C11.2 33.33,16.89 30.73,19.49 L1.P$2
  Route2 0.406: 85.34,46.99 76.2,46.99 76.07,46.86 74.93,45.72 74.93,36.87 CN10.3 | 85.34,46.99 v87.63,46.99 | v105.41,49.53 110.62,44.32 110.62,35.73 CN9.3 | v50.8,49.53 50.16,50.16 50.16,67.94 48.3,69.81 CN5.3 | v7.33,59.56 7.49,59.56 v8.89,58.17 8.89,54.36 8.14,53.61 v8.02,53.61 | CN6.3 83.82,69.85 85.34,68.33 85.34,46.99
  Route2 0.508: v38.1,41.91 36.83,41.91 v35.56,40.64 | v50.8,49.53 52.07,48.26 64.77,48.26 66.17,46.86 76.07,46.86
  Route2 0.61: v36.83,15.24 35.05,13.46 24.89,13.46 22.86,11.43 13.59,11.43 v10.54,14.48 10.54,14.35 7.72,11.53 2.7,11.53 1.27,12.95 1.27,45.72 8.02,52.47 v8.02,53.61
  Route15 0.406: 44.34,78.74 44.34,80.42 44.32,80.44 44.32,89.41 45.05,90.13 CN1.3 | 44.34,78.74 44.34,71.23 45.76,69.81 CN5.3 | v32.89,79.98 36.86,79.98 38.1,78.74 44.34,78.74 | CN6.3 85.09,71.08 85.09,88.9 83.86,90.13 CN2.3 | CN9.3 109.22,34.29 109.26,34.29 111.76,31.79 111.76,17.82 CN3.3 | CN4.3 73.66,15.28 73.66,33.06 CN10.3
  Bottom 0.406: J8.6 29.21,81.53 30.76,79.98 v32.89,79.98
!RESET  (via drill 0.35)
  Top 0.254: R4.1 39.72,50.52 39.72,50.48 37.53,50.48 v37.02,49.97 36.83,50.16 SWD.P$10 | U4.40 19.07,51.73 RESET.P$2 18.59,50.76 18.67,50.67 18.67,50.17 18.31,49.81 17.78,49.81 | 17.78,49.81 15.86,49.81 RESET.P$1 | 17.78,49.81 17.78,48.65 18.01,48.42 v19.65,48.42
  Route15 0.254: v19.65,48.42 22.78,48.42 24.83,50.47 36.53,50.47 v37.02,49.97
  Bottom 0.254: TP19.1 37.08,51.05 37.08,50.04 v37.02,49.97
+3V3A  (via drill 0.35)
  Top 0.254: IC1.4 38.08,70.55 C21.1 v37.08,70.66 C22.1 36.08,70.54 IC1.8 | IC1.11 34.58,68.8 33.15,70.23 C23.1 | IC1.21 31.3,62.25 30.52,61.47 C28.1 | IC1.17 31.46,64.25 C27.1 | C24.1 31.47,65.76 31.47,65.46 31.69,65.25 IC1.15
  Top 0.305: RN3.1 RN3.2 | C24.1 C27.1 | 30.48,69.47 31.67,70.66 C23.1 | R14.2 25.78,69.09 L2.2
  Top 0.406: v30.99,68.96 30.48,69.47 C25.1 27.94,68.2 v27.3,68.2 | v24.26,84.33 24.16,84.23 RN3.1 | v30.23,62.48 30.31,62.4 C28.1
  Top 0.508: 27.94,68.2 26.67,68.2 L2.2 | C24.1 30.43,68.25 C25.1
  Route15 0.406: v37.08,70.66 32.68,70.66 v30.99,68.96 30.99,63.5 30.48,62.99 30.48,62.74 v30.23,62.48 | v27.3,68.2 24.26,71.25 v24.26,84.33
+3V3D  (via drill 0.35, 0.6)
  Top 0.254: 35.58,58.57 IC1.28 35.58,58.44 35.31,58.17 34.97,58.17 34.46,57.66 C31.2 | IC1.45 IC1.44 IC1.43
  Top 0.305: C31.2 34.24,57.19 33.85,56.8 v33.53,56.8 | IC1.44 41.09,64.26 v42.42,64.26
  Top 0.508: L3.2 43.41,73.05 43.41,69.7 C26.1 43.05,67.06 v43.05,66.67
  Route15 0.508: v43.05,66.67 43.05,64.9 v42.42,64.26 42.42,60.2 39.37,57.15 33.88,57.15 v33.53,56.8
ACT  (via drill 0.35)
  Top 0.254: IC1.27 35.08,60.14 34.87,60.36 33.79,60.36 33.49,60.06 v32.38,60.06
  Top 0.305: v28.7,60.07 28.7,60.33 26.67,62.36 26.67,65.15 24.69,67.13 16.26,67.13 11.43,71.96 v11.43,73.66
  Route2 0.305: v32.38,60.06 32.32,59.99 28.78,59.99 v28.7,60.07 | X3.12 5.08,80.01 v11.43,73.66
D13
  Top 0.254: U4.26 15.18,59.4 14.42,58.64 10.96,58.64 10.65,58.95 RN1.6
D38  (via drill 0.35)
  Top 0.254: U4.22 18.57,62.33 18.27,62.62 13.73,62.62 v13.59,62.48
  Route2 0.254: v13.59,62.48 13.34,62.48 12.57,63.25 7.35,63.25 2.18,68.42 2.18,82.15 12.48,92.46 25.65,92.46 31.75,86.36 v31.75,85.09
  Bottom 0.254: v31.75,85.09 J8.5
D+  (via drill 0.35)
  Top 0.254: 7.26,56.16 7.02,56.4 USB1.B6 6.39,56.39 5.33,56.39 5.08,56.64 5.08,57.15 5.33,57.4 USB1.A6 | 7.26,56.16 8.49,54.93 U1.6 | v7.41,56.29 7.27,56.16 7.26,56.16
  Bottom 0.254: TP16.1 5.49,56.29 v7.41,56.29
D-  (via drill 0.35)
  Top 0.254: USB1.A7 8.79,56.9 | 8.79,56.9 U1.4 | USB1.B7 7.62,57.9 | 7.62,57.9 7.79,57.9 8.79,56.9 | v7.62,57.81 7.62,57.9
  Bottom 0.254: TP15.1 7.01,58.42 v7.62,57.81
DIPSW1  (via drill 0.35)
  Top 0.254: U4.30 15.12,57.4 v14.73,57.78 | ID.16 17.78,41.78 v17.27,41.27
  Route2 0.254: v14.73,57.78 14.73,54.86 16.87,52.73 16.87,42.25 17.27,41.84 v17.27,41.27
DIPSW2  (via drill 0.35)
  Top 0.254: ID.15 20.32,43.18 17.4,40.26 v16.34,40.26 | U4.37 16.79,52.9 v16.26,52.37
  Route2 0.254: v16.34,40.26 16.34,52.37 v16.26,52.37
DIPSW3  (via drill 0.35)
  Top 0.254: ID.14 v22.86,46.99 | U4.47 22.57,52.03 v22.93,51.67
  Route2 0.254: v22.86,46.99 22.86,47.02 22.25,47.63 22.25,50.99 v22.93,51.67
DIPSW4  (via drill 0.35)
  Top 0.254: v20.83,41.02 22.99,43.18 24.89,43.18 25.4,43.69 ID.13 | U4.38 18.07,51.97 17.78,51.68 17.78,50.7 v18.06,50.42
  Route2 0.254: v20.83,41.02 18.19,43.66 18.19,50.42 v18.06,50.42
DIPSW5  (via drill 0.35)
  Top 0.254: v19.56,60.07 19.4,60.07 19.18,60.29 18.28,60.29 18.07,60.5 U4.23 | v27.05,43.05 27.94,43.94 ID.12
  Route2 0.254: v19.56,60.07 20.65,58.98 20.65,43.82 24.56,39.91 26.97,39.91 27.4,40.34 27.4,42.7 v27.05,43.05
DIPSW6  (via drill 0.35)
  Top 0.254: U4.12 25.99,59.9 v26.04,59.94 | ID.11 30.48,43.18 29.84,42.55 27.56,42.55 27.18,42.16 v26.67,42.16
  Route2 0.254: v26.04,59.94 25.89,59.94 25.3,59.36 25.3,55.28 26.04,54.55 26.04,48.66 26.13,48.56 26.13,42.7 v26.67,42.16
DIPSW7  (via drill 0.35)
  Top 0.254: U4.14 22.57,60.5 22.73,60.34 v22.73,59.56 | ID.10 33.02,43.18 31.24,41.4 v26.04,41.4
  Route2 0.254: v22.73,59.56 24.03,59.56 24.8,58.8 24.8,55.12 25.53,54.39 25.53,49.35 24.71,48.53 24.71,47.79 25.65,46.84 25.65,41.78 v26.04,41.4
DIPSW8  (via drill 0.35)
  Top 0.254: U4.16 21.57,60.5 21.34,60.27 v21.34,59.94 | v26.67,40.64 26.92,40.89 33.91,40.89 35.56,42.55 ID.9
  Route2 0.254: v21.34,59.94 21.34,59.58 21.16,59.4 21.16,56.8 21.34,56.62 21.34,43.92 24.62,40.64 v26.67,40.64
EM_1  (via drill 0.35)
  Top 0.254: U4.7 23.48,57.4 v23.37,57.29 | v22.86,67.76 v22.86,67.75 22.86,67.75 17.71,67.75 17.7,67.76 v17.34,67.76
  Route2 0.254: J7.1 17.78,89.28 17.78,87.63 16.05,85.9 16.05,82.21 13.51,79.67 13.51,70.23 15.98,67.76 v17.34,67.76
  Route15 0.254: v23.37,57.29 23.37,67.26 v22.86,67.76
EM_2  (via drill 0.35)
  Top 0.254: U4.11 23.79,59.4 23.54,59.64 23.54,63.98 v24.3,64.73 | v21.84,68.35 v17.97,68.35
  Route2 0.254: J7.2 16.46,85.42 16.46,82.05 13.92,79.5 13.92,70.4 15.87,68.45 17.62,68.45 17.71,68.35 v17.97,68.35 | v24.3,64.73 21.84,67.18 v21.84,68.35
EM_3  (via drill 0.35)
  Top 0.254: U4.24 17.57,61.65 17.32,61.91 15.96,61.91 v15.14,61.09
  Route2 0.254: v15.14,61.09 15.34,61.28 15.34,63.5 15.34,67.21 12.7,69.85 12.7,80.01 15.24,82.55 15.24,89.28 J7.3
EM_4  (via drill 0.35)
  Top 0.254: v22.35,64.04 22.35,64.01 22.07,63.73 22.07,62.57 U4.15
  Route2 0.254: J7.4 16.51,87.25 15.65,86.39 15.65,82.38 13.11,79.84 13.11,70.02 16,67.12 v16,65.94
  Route15 0.254: v16,65.94 16.38,65.56 20.83,65.56 v22.35,64.04
G1
  pour Top (isolate 0.254): 0,5 arc90 5,0 115,0 arc90 120,5 120,7 116,7 116,10 4,10 4,7 0,7
G2
  pour Route2 (isolate 0.254): 4,10.16 4,7 0,7 0,5 arc90 5,0 115,0 arc90 120,5 120,7 116,7 116,10.16
G3
  pour Route15 (isolate 0.254): 4,10.16 4,7 0,7 0,5 arc90 5,0 115,0 arc90 120,5 120,7 116,7 116,10.16
G4
  pour Bottom: 4,10 4,7 0,7 0,5 arc90 5,0 115,0 arc90 120,5 120,7 117,7 arc-90 116,8 116,10
G5
  pour Top (isolate 0.254): 5,104 arc90 0,99 0,97 4,97 4,94.16 116,94.16 116,97 120,97 120,99 arc90 115,104
G6
  pour Route2 (isolate 0.254): 5,104 arc90 0,99 0,97 4,97 4,94.16 116,94.16 116,97 120,97 120,99 arc90 115,104
G7
  pour Route15 (isolate 0.254): 4,94.16 4,97 0,97 0,99 arc-90 5,104 115,104 arc-90 120,99 120,97 116,97 116,94.16
G8
  pour Bottom (isolate 0.254): 0,99 arc-90 5,104 115,104 arc-90 120,99 120,97 116,97 116,94.16 4,94.16 4,97 0,97
GND  (via drill 0.3 pad 0.3, 0.35, 0.4 pad 0.3, 0.6)
  Top 0.152: 65.52,76.06 65.52,75.16 | U5.21 60.85,76.69 62.38,75.16 62.52,75.16 | 102.27,75.16 102.75,75.64 102.75,76.37 102.98,76.6 | 102.98,80.12 103,80.14 | 98.27,76.2 98.27,75.16 | U7.59 92.71,34.97 92.7,34.96 | 90.06,26.02 89.92,26.16 89.92,26.68 90.29,27.05 90.49,27.05 90.87,27.43 90.87,29.41 | 90.06,24.02 90,23.96 | 93.87,29.41 95.11,28.17 95.11,27.77 95.36,27.53 | 58.28,27.77 58.28,27.88 | 53,25.86 53,26.67 53,26.86 | 53.2,23.86 53.23,23.89 | 55.43,39.2 C86.2 | U6.59 100.33,68.96
  Top 0.2: 65.52,76.06 66.15,76.69 U5.8 66.15,79.99 66.29,80.14 | U5.21 60.85,79.74 60.58,80.01 | U5.59 63.5,69.09 | 102.98,76.6 U6.8 102.98,80.12 | 90.06,26.02 U7.8 90.06,24.02 | 95.36,27.53 U7.21 95.36,24.4 95.5,24.26 | 58.28,27.77 58.53,27.53 U8.21 58.53,24.13 58.6,24.06 | 53,25.86 53.23,25.63 U8.8 53.23,23.89 | U8.59 55.88,34.84 | U6.21 97.68,76.79 98.27,76.2 | C35.2 21.29,75.74 v21.84,75.18 | C61.1 63.25,64.64 63.55,64.94 C55.2 | 55.88,34.29 55.12,35.05 55.12,36.9 55.13,36.91 55.13,37.23 54.62,37.73 54.62,39.13 54.74,39.24 55.33,39.24 C86.2 | 92.71,34.29 91.95,35.05 91.95,36.96 91.44,37.47 91.44,39.37 92.16,39.37 C85.2 | 100.33,68.96 100.38,68.91 100.93,68.91 101.09,68.75 101.09,67.32 101.22,67.19 101.22,67.15 101.6,66.77 101.6,65.02 101.52,64.94 C56.2
  Top 0.203: IC1.29 36.07,59.26 36.07,61.85 | v41.91,69.85 40.56,69.85 40.56,67.43 41.08,66.91 IC1.48 39.99,66.25 39.58,65.83 39.58,63.5 39.95,63.12 39.95,60.38 40.44,59.89 40.44,59.83 40.64,59.63 40.64,55.42 | C48.1 103.76,80.9 102.98,80.12
  Top 0.254: C29.1 29.5,64.3 30.75,64.3 31.03,64.03 31.03,63.91 31.69,63.25 IC1.19 v34.29,63.25 | 28.21,56.4 U4.5 23.13,56.4 v22.73,56.01 | 20.07,51.19 U4.42 20.07,54.99 v19.81,55.24 | 35.58,71.61 IC1.9 35.58,65.75 35.54,65.79 v34.04,65.79 | U2.2 18.41,19.94 v17.78,19.3 | 100.33,68.96 100.2,69.09 99.19,69.09 99.19,71.08 99.27,71.16 | C22.2 36.83,71.58 | 36.83,71.58 C21.2 38.29,71.26 38.3,71.26 38.58,70.98 IC1.3 38.58,66.14 37.34,64.9 37.08,64.9 35.56,63.37 35.56,63.25 | Q3.2 49.53,50.8 44.45,50.8 C38.1 43.56,52.88 43.18,52.5 43.18,51.34 37.56,45.72 36.83,45.72 | ID.3 v22.86,40.39 21.84,39.37 v21.59,39.37 | U1.2 v10.16,55.88 | C11.1 C12.1 v36.83,11.43 | 33.27,13.59 C11.1 | C10.2 C9.2 | 16.53,36.34 ID.1 ID.2 ID.3 | ID.3 ID.4 ID.5 ID.6 ID.7 | 15.75,47.62 16.51,47.62 16.51,46.74 v19.94,46.74 20.32,46.74 C10.2 | 15.75,47.62 15.62,47.62 15.62,39.12 v16.64,38.1 | 28.45,56.64 28.4,56.64 C7.2 29.21,55.63 29.21,49.53 C6.1 | 29.34,57.15 R12.1 29.64,58.42 C30.1 29.64,60.71 29.38,60.96 C28.2 28.7,61.47 C29.1 | 29.34,57.15 C5.2 | C29.1 28.7,65.28 C27.2 C24.2 29.46,66.85 v29.46,67.82 | C23.2 33.15,72.77 | 35.6,71.58 35.6,71.88 R11.1 34.67,72.77 33.15,72.77 | v34.29,63.25 | IC1.16 34.29,64.75 | v34.29,63.25 34.29,64.75 | 36.07,61.85 36.07,63.25 35.56,63.25 | 35.56,63.25 v34.29,63.25 | X2.2 38.15,55.42 C32.2 40.64,55.42 41.53,55.42 v41.53,56.77 | C31.1 32.56,57.66 32.56,57.15 | 32.56,57.15 32.56,54.61 31.75,54.61 v31.75,54.24 | 29.34,57.15 32.56,57.15 | v31.37,72.77 33.15,72.77 | v81.28,20.32 81.92,20.95 90.3,20.95 91.11,21.76 C75.2 | 46.61,22.86 C83.1 v44.07,23.24 | R19.2 47.83,75.23 v46.61,76.45 | C80.1 46.48,37.72 46.48,45.72 C94.- 48.26,43.18 49.53,41.91 C98.1 51.69,40.26
  Top 0.254: C96.1 51.69,40.26 | 51.69,40.26 51.69,41.4 53.21,41.4 | C45.2 68.09,82.63 68.28,82.83 73.94,82.83 v74.93,83.82 | R3.1 5.46,12.7 S6.P1 | v46.61,76.45 v46.61,75.44 v46.61,74.42 v46.61,73.41 | v80.52,75.95 v80.52,74.93 | v80.52,74.93 v80.52,73.91 v80.52,72.9 | v83.31,74.93 v83.31,75.95 83.31,77.09 83.95,77.72 C18.1 | v83.31,74.93 v83.31,73.91 v83.31,72.9 | v117.22,73.41 v117.22,74.42 v117.22,75.44 v117.22,76.45 | C77.1 83.82,41.91 85.09,41.91 | 85.09,41.91 86.36,41.91 | C93.- 85.09,41.91 | 99.95,39.12 95.25,43.81 C89.- | 109.6,27.86 v109.6,28.7 v109.6,29.72 v109.6,30.73 | v72.77,28.45 v72.77,29.46 v72.77,30.48 v72.77,31.5 | v75.82,31.5 v75.82,30.48 v75.82,29.46 | v75.82,29.46 v75.82,28.45 | C73.1 89.28,23.24 90.06,24.02 | v40.01,26.8 v38.99,26.8 v38.99,27.81 v38.99,28.83 39.88,27.94 39.88,28.88 R28.2 | C15.2 20.57,62.82 U4.18 20.57,60.07 19.97,59.46 18.54,59.46 18.06,59.94 17.65,59.94 | v21.21,66.04 22.99,66.04 22.99,65.91 | J2.6 38.86,79.25 39.12,79.5 v39.12,80.01 43.31,80.01 | J2.SHIELD3 43.31,80.01 | J2.SHIELD2 27.81,86.36 | 27.81,86.36 27.81,84.13 28.71,83.23 J2.SHIELD1 29.21,77.59 29.21,76.96 | 27.81,86.36 43.18,86.36 | 43.31,80.01 43.31,85.09 43.18,85.09 43.18,86.36 | C58.1 102.87,62.61 | 102.87,62.61 103.25,62.23 104.52,62.23 | C56.2 100.84,62.61 | 100.84,62.61 102.87,62.61 | C62.1 99.44,63.63 99.95,63.12 | 100.84,62.61 100.46,62.61 99.95,63.12 | C87.1 90.17,41.66 89.92,41.91 | 89.92,41.91 88.52,41.91 | C85.2 92.2,40.64 | 92.2,40.64 92.2,41.53 91.82,41.91 89.92,41.91 | C91.1 93.6,40.51 | 93.6,40.51 93.22,40.89 92.46,40.89 92.2,40.64 | U7.EPAD9 92.71,34.29 92.71,34.97 | C88.1 53.34,41.27 53.21,41.4
  Top 0.254: C86.2 55.37,40.89 54.86,41.4 | 54.86,41.4 53.21,41.4 | C92.1 56.64,39.62 56.64,40.64 56.39,40.89 | 56.39,40.89 55.88,41.4 54.86,41.4 | C76.2 54.66,21.89 53.98,21.21 v45.21,21.21 | 55.88,34.84 55.88,34.29 U8.EPAD9_VIA12 | 53,26.67 53,27.2 U8.EPAD9_VIA1 | U8.EPAD9 58.28,28.11 58.28,27.77 | 58.6,24.06 59.42,23.24 C78.1 64.9,23.11 v66.67,23.11 67.67,23.11 70.56,26 72,26 72.6,25.4 C20.1 | v21.21,66.04 21.21,65.91 | 17.91,66.04 v21.21,66.04 | v22.48,68.96 22.05,69.39 C34.2 | 63.5,69.09 U5.EPAD9_VIA12 | v80.52,74.93 R20.2 | v83.31,74.93 R21.2 | R26.2 76.07,29.21 v75.82,29.46 | v24.13,21.59 D2.1 22.17,19.38 21.97,19.18 C3.1 23.11,17.02 23.39,16.74 C2.2 C1.2 29.72,15.24 v29.21,15.24 | R29.1 7.62,61.21 7.36,61.47 USB1.S27 | USB1.S25 USB1.S26 6.25,60.5 USB1.A1_B12 | USB1.S20 USB1.S24 | USB1.S8 USB1.S19 | X3.SHIELD1 10.65,67.06 10.58,66.98 7.62,66.98 | X3.SHIELD1 | C39.1 v48.26,58.42 | J2.SHIELD4 43.18,87.56 43.18,86.36 | C17.1 47.12,77.72 46.61,77.22 v46.61,76.45 | CN9.1 109.22,40.89 108.71,41.4 108.71,45.59 108.84,45.72 C69.1 | C70.1 71.75,45.72 71.63,45.59 71.63,43.05 72.39,42.29 CN10.1 | USB1.S8 2.54,61.47 | USB1.S7 USB1.S8 | X1.P$1 6.86,37.31 8.03,38.48 | J1.P$54 6.23,40.78 6.23,41.78 | C19.1 109.73,26.42 109.6,26.54 v109.6,27.69 | 13.52,66.23 X3.SHIELD1 | 7.62,66.98 6.2,66.98 3.3,64.08 3.3V.- | 15.75,47.62 15.75,49.02 14.5,49.02 RESET.P$3 13.65,49.09 13.34,49.4 13.34,52.7 12.7,53.34 12.7,54.23 C16.2 13.63,54.9 U4.35 17.43,54.9 v18.16,55.63 | RESET.P$4 20.3,49.09 C10.2 | C11.1 33.78,11.94 v34.29,11.43 | USB1.S30 USB1.S37 | SWD.P$5 SWD.P$3 33.02,48.75 32.37,49.4 31.36,49.4 31.09,49.14 31.09,48.87 v29.21,46.99
  Top 0.254: L.- 7.75,66.85 7.62,66.98 | 29.84,74.8 29.21,75.44 29.21,76.96 | C40.1 83.95,55.88 v83.82,55.88 | v31.75,15.24 33.78,15.24 | 33.78,15.24 C11.1 | v37.08,72.14 37.08,71.84 36.83,71.58 | C29.1 27.81,62.61 v27.81,62.48 | IC1.14 34,65.75 v34.04,65.79 | 34.29,64.75 34.29,65.54 v34.04,65.79 | v57.66,40.89 56.39,40.89 | v94.36,40.89 93.98,40.51 93.6,40.51 | v98.68,63.12 99.95,63.12 | v34.29,15.24 33.78,15.24 | v30.23,77.34 29.84,76.96 29.21,76.96 | C33.2 34.42,56.52 35.22,57.31 X2.4 36.08,57.59 IC1.29
  Top 0.305: 28.21,56.4 28.45,56.64 28.4,56.69 C5.2 | C10.2 20.03,49.36 19.98,49.36 19.69,49.66 19.68,49.66 19.68,50.8 20.07,51.19 | 35.6,71.58 C22.2 | U2.2 18.41,20.83 R2.1 20.45,24.13 19.56,24.13 R1.1 | v62.99,62.23 62.48,62.74 62.61,62.87 C61.1 | C12.1 37.21,13.97 v39.37,13.97 39.37,18.16 38.99,18.54 C13.2 | v39.37,11.43 v36.83,11.43 | 54.99,66.04 C47.1 56.77,66.42 58.42,64.77 58.42,61.98 59.94,60.45 60.96,60.45 C63.- | C67.1 69.85,62.23 | C65.1 67.69,62.23 | 67.69,62.23 69.85,62.23 | 69.85,62.23 69.85,58.42 C59.- 72.74,58.42 72.74,65.88 72.39,65.88 C49.1 | C51.1 v75.18,80.9 | C43.1 54.48,80.77 v52.96,80.77 | C64.- 96.9,58.42 95.12,60.2 95.12,61.85 91.44,65.53 C50.1 | C68.1 106.68,62.23 | C66.1 104.52,62.23 106.68,62.23 | 106.68,62.23 106.68,58.42 C60.- 109.47,59.94 109.47,66.17 C44.1 | C48.1 112.27,80.9 v112.27,80.39 | R22.2 116,74.8 117.22,73.58 v117.22,73.41 | C53.1 89.28,80.9 v89.28,81.15 | R20.2 79.17,71.25 v79.25,71.25 | C95.1 88.52,41.91 86.36,41.91 C97.1 | C73.1 80.64,23.24 v80.64,23.62 | v103.12,22.35 103.12,23.24 C79.1 96.52,23.24 95.5,24.26 | C81.1 101.6,38.73 101.22,39.12 99.95,39.12 | C46.2 102.23,83.39 v102.23,83.44 | v16.64,38.1 16.53,37.99 16.53,36.34 | v10.67,16.89 10.67,17.91 R6.1 | 109.6,27.86 v109.6,27.69 | v109.6,28.7 109.09,29.21 R25.2 | 72.77,28.63 v72.77,28.45 | v72.77,29.46 72.52,29.21 R27.2 | 75.82,31.32 v75.82,31.5 | C90.- 60.58,43.56 60.58,38.48 61.34,37.72 C74.1 | C15.2 20.62,65.45 v21.21,66.04 | C57.1 65.79,62.48 66.04,62.23 67.69,62.23 | C14.1 34.67,32.13 35.56,33.02 ID.8 35.56,39.37 36.83,40.64 36.83,45.72 | v36.45,24 35.18,24 35,24.18 U3.1 | USB1.B1_A12 6.4,53.1 USB1.S46
  Top 0.305: USB1.S37 USB1.S38 USB1.S39 | USB1.S39 USB1.S40 | USB1.S37 USB1.S39 | USB1.S37 USB1.S40 | USB1.S37 USB1.S41 | USB1.S42 USB1.S45 | USB1.S45 USB1.S47 | USB1.S41 USB1.S45 | USB1.S40 USB1.S41 | v10.16,55.88 10.55,55.48 10.55,54.27 10.92,53.91 R30.2 10.92,52.32 10.69,52.09 7.11,52.09 USB1.S48
  Top 0.406: R3.1 9.4,13.97 9.4,15.62 v10.67,16.89 | v20.32,18.67 v20.32,17.78 | v20.32,16.89 v20.32,17.78 | v20.32,17.78 v19.68,17.78 | U2.9 18.8,17.78 v19.68,16.89 | C3.1 21.08,17.02 v20.32,17.78 | 116.97,73.15 v117.22,73.41
  Top 0.508: C26.2 v41.91,69.85 | U3.1 34.67,25.5 C14.1
  Top 0.813: C25.2 v31.37,72.77
  Route2 0.2: 52.83,26.29 53.38,26.29 v53.49,26.18
  Route2 0.203: 23.77,39.4 29.5,39.4 31.18,37.72 34.33,37.72 45.76,26.29 52.83,26.29 | 22.73,38.23 29.59,38.23 30.86,36.96 34.01,36.96 45.94,25.02 54.61,25.02
  Route2 0.254: v39.12,80.01 40.01,80.9 50.67,80.9 | 23.77,39.4 22.86,40.31 v22.86,40.39 | 22.73,38.23 v21.59,39.37 17.78,43.18 17.78,49.15 | v39.12,80.01 39.7,79.42 67.58,79.42 68.41,78.59 99.45,78.59 99.98,79.12 111,79.12 v112.27,80.39 | 22.38,73.87 27.76,79.25 38.35,79.25 v39.12,80.01 | 16.51,58.42 16.51,60.48 17.4,61.37 17.4,65.82 22.38,70.8 22.38,73.87 | 0.73,68.13 6.85,62.02 7.45,62.02 11.43,58.04 11.43,54.9 13.72,52.61 14.22,52.61 14.58,52.96 14.58,53.46 14.12,53.92 14.12,58.1 17.15,61.12 17.15,66.07 22.02,70.94 22.02,73.51 22.38,73.87 | v22.48,68.96 23.62,70.1 23.62,73.66 28.19,78.23 29.34,78.23 v30.23,77.34
  Route2 0.305: v52.96,80.77 50.8,80.77 50.67,80.9
  Bottom 0.2: C90.- 58.42,43.81 | 57.23,43.81 48.9,43.81 48.26,44.45 C94.- 48.26,40.64 46.68,40.64 | 104.39,21.72 104.39,21.34 106.68,19.05 106.72,19.01 | v53.49,26.18 53.49,27.69 U8.EPAD9_VIA1 | 14.35,51.05 18.41,46.99
  Bottom 0.254: v16.64,38.1 19.05,40.51 | 18.41,46.99 19.94,46.99 | 19.94,46.99 22.13,46.99 22.13,47.59 23.59,47.59 | 23.59,47.59 23.59,46.99 27.94,46.99 | 27.94,46.99 v29.21,46.99 | v31.75,54.24 24.13,54.24 | 24.13,54.24 v24.13,52.07 24.13,47.59 23.59,47.59 | v19.94,46.74 19.94,46.99 | 14.35,51.05 14.35,52.1 11.43,52.1 11.43,55.88 | 11.43,55.88 11.43,59.69 12.7,59.69 12.7,61.62 | v10.16,55.88 11.43,55.88 | 12.7,61.62 13.66,61.62 | 14.27,62.23 17.14,62.23 17.14,66.04 | 31.37,71.12 v31.37,72.77 33.4,74.8 v33.66,74.8 | 15.24,67.31 15.24,68.96 v22.48,68.96 22.48,71.12 | 15.24,67.31 15.24,66.93 17.14,66.93 17.14,66.04 | 12.7,82.55 X3.SHIELD2 6.8,90.16 S5.P1 11.42,90.16 11.43,90.17 | 12.7,82.55 X3.SHIELD1 12.96,67.31 15.24,67.31 | v46.61,76.45 50.8,72.26 | 50.8,63.5 50.8,72.26 | 50.8,72.26 50.8,73.28 | C63.- 55.88,63.5 50.8,63.5 | 68.58,23.11 68.58,39.37 68.62,39.33 | 67,43.81 58.42,43.81 57.23,43.81 | 44.07,26.67 v44.07,23.24 44.07,22.35 v45.21,21.21 45.21,18.54 43.18,16.51 v41.91,16.51 v41.91,13.97 | 43.18,26.67 43.18,40.64 46.68,40.64 | 67,50.8 S2.P1 67,53.43 62.99,57.44 v62.99,62.23 64.26,63.5 64.26,70.5 U5.EPAD9_VIA12 | 67,50.8 67,43.81 | v80.64,23.62 80.64,20.32 v81.28,20.32 81.28,16.51 v78.74,16.51 v78.74,11.43 | v66.67,23.11 68.58,23.11 | X3.8 15.88,79.38 12.7,82.55 | v83.31,75.95 v80.52,75.95 80.52,79.5 v80.01,80.01 | 67,43.81 71.12,43.81 | 71.12,43.81 85.09,43.81 C93.- C89.- 97.53,48 106,48 109.22,44.78 CN9.1 | 80.64,30.48 v75.82,30.48 | v75.82,31.5 v72.77,31.5 | v21.21,66.04 17.14,66.04 | 50.8,63.5 46.99,63.5 CN5.1 | v89.28,81.15 89.28,82.17 86.32,85.13 CN2.1 | 68.58,23.11 68.58,19.05 68.62,19.01 CN4.1
  Bottom 0.254: v15.24,16.89 v15.24,17.78 v15.24,18.67 v15.88,18.67 | v19.05,19.3 21.34,21.59 v24.13,21.59 25.91,23.37 v25.91,24.77 | v19.05,19.3 v17.78,19.3 v16.51,19.3 v15.88,18.67 | v15.88,18.67 v15.88,17.78 v15.88,16.89 v16.51,16.26 | v17.78,16.26 v19.05,16.26 v19.68,16.89 v20.32,16.89 | v19.05,19.3 v19.68,18.67 v20.32,18.67 | 22.48,71.12 22.48,74.55 v21.84,75.18 21.97,75.31 21.97,75.92 25.15,79.09 v25.15,79.25 | J8.1 41.91,84.84 35.31,91.44 | 11.43,90.17 11.43,91.44 12.7,92.71 25.4,92.71 25.4,91.44 | 11.43,90.17 11.43,88.9 12.32,88.01 J7.6 | 14.31,62.27 14.27,62.23 | 14.27,62.23 13.66,61.62 | TP2.1 v39.37,13.97 v41.91,13.97 | 50.8,63.5 50.8,60.96 v48.26,58.42 52.07,58.42 v52.07,55.88 53.34,55.88 v53.34,50.8 v58.42,50.8 67,50.8 | CN1.1 46.99,83.82 50.04,80.77 v52.96,80.77 | CN6.1 83.82,60.96 | 71.12,43.81 72.39,42.55 CN10.1 | 15.24,24.13 7.11,32.26 X1.P$1 | USB1.S7 USB1.S27 | USB1.S23 5.95,61.62 12.7,61.62 | v31.75,54.24 33.1,54.24 34.29,55.43 v34.29,63.25 | 31.37,71.12 22.48,71.12 | 24.13,54.24 24.13,61.72 v24.26,61.72 | v41.91,13.97 v41.91,11.43 | v36.45,24 36.45,31.37 39.37,34.29 v39.37,43.18 | v41.91,69.85 36.83,69.85 | 36.83,69.85 31.75,69.85 31.37,70.23 31.37,71.12 | v13.46,61.47 13.51,61.47 13.66,61.62 | v118.75,55.88 v118.75,66.04 v118.75,71.12 117.22,71.12 | 67,50.8 v73.66,50.8 v78.74,50.8 v83.82,50.8 v88.9,50.8 | v88.9,50.8 v88.9,55.88 v83.82,55.88 | v118.75,45.72 v114.3,45.72 | v114.3,35.56 v114.3,40.64 v114.3,45.72 | v114.3,55.88 v118.75,55.88 | v63.5,92.71 v53.34,92.71 v48.26,92.71 | 74.93,92.71 v68.58,92.71 v63.5,92.71 | 74.93,92.71 v78.74,92.71 v83.82,92.71 v88.9,92.71 v93.98,92.71 v99.06,92.71 v104.14,92.71
  Bottom 0.254: v74.93,83.82 74.93,86.36 | 74.93,86.36 v73.66,86.36 | 74.93,86.36 74.93,92.71 | v48.26,15.24 v48.26,11.43 v53.34,11.43 v58.42,11.43 v63.5,11.43 | v63.5,11.43 v73.66,11.43 | v31.75,15.24 v29.21,15.24 v26.67,15.24 v24.13,15.24 | v37.08,69.09 36.83,69.35 36.83,69.85 | v31.75,54.24 31.5,54.49 v31.5,55.88 | v27.81,62.48 27.81,61.06 27.08,60.32 27.08,59.82 27.18,59.72 v27.18,58.04 | v25.4,83.82 v25.4,87.63 25.4,91.44 | 25.4,91.44 v29.21,91.44 v33.02,91.44 35.31,91.44 | v43.18,92.71 v38.1,92.71 36.83,91.44 35.31,91.44 | v88.9,50.8 v93.98,50.8 v99.06,50.8 v104.14,50.8 v109.22,50.8 114.3,50.8 v114.3,45.72 | v118.75,35.56 v118.75,40.64 v118.75,50.8 v118.75,55.88 | v63.5,11.43 v68.58,11.43 v73.66,11.43 | v73.66,11.43 v78.74,11.43 | v78.74,11.43 v88.9,11.43 v93.98,11.43 v99.06,11.43 v104.14,11.43 v109.22,11.43 | v118.75,60.96 v118.75,55.88 | v58.42,92.71 v63.5,92.71 | v31.75,43.18 28.7,43.18 27.94,43.94 27.94,46.99
  Bottom 0.305: C63.- 62.99,58.42 v62.99,62.23 | v74.93,83.82 75.18,83.57 v75.18,80.9 77.47,80.9 77.47,68.58 | v52.96,80.77 52.96,75.44 50.8,73.28 | C59.- 71.12,60.87 71.18,60.96 77.47,60.96 | 77.47,60.96 83.82,60.96 88.9,60.96 | 88.9,60.96 97.79,60.96 | 107.95,60.96 97.79,60.96 | 111.12,60.96 111.12,79.25 v112.27,80.39 112.27,90.16 S3.P1 | v117.22,73.41 117.22,71.12 117.22,60.96 111.12,60.96 | v79.25,71.25 79.25,68.58 77.47,68.58 | v80.64,23.62 80.64,30.48 | v103.12,22.35 103.12,21.72 104.39,21.72 104.39,29.21 104.39,39.37 | v102.23,83.44 102.23,82.88 101.68,82.32 101.68,81.36 99.27,78.95 99.27,76.16 | 77.47,68.58 77.47,60.96 | 88.9,60.96 89.28,61.34 v89.28,81.15 | C64.- 97.79,60.96 | C60.- 107.95,60.96 | 111.12,60.96 107.95,60.96 | 44.07,26.67 43.18,26.67 40.13,26.67 v40.01,26.8 | v36.45,24 36.45,16.89 v39.37,13.97
  Bottom 0.406: 15.24,19.05 15.24,24.13 | 15.24,19.05 v15.24,18.67 | v10.67,16.89 12.83,19.05 15.24,19.05 | S4.P1 111.15,19.01 CN3.1 107.91,19.05 106.68,19.05 | v109.6,28.7 109.09,29.21 104.39,29.21
  pour Bottom (isolate 0.254, rank 6, no thermals): 0,10.16 120,10.16 120,94.16 0,94.16
  pour Top (isolate 0.254, rank 6, no thermals): -2,10.16 -2,94.16 120,94.16 120,10.16
  pour Top (isolate 0.254, no thermals): 85.09,77.22 82.42,77.22 82.42,72.26 85.09,72.26
  pour Top (isolate 0.254, no thermals): 78.49,72.26 81.41,72.26 81.41,77.22 78.49,77.22
  pour Top (isolate 0.254, no thermals): 48.26,73.28 48.26,77.22 48.13,77.34 45.09,77.34 44.96,77.22 44.96,73.03 45.09,72.9 47.88,72.9
  pour Top (isolate 0.254, no thermals): 118.11,77.47 115.57,77.47 115.57,72.39 118.11,72.39
  pour Top (isolate 0.254, no thermals): 110.49,31.75 107.95,31.75 107.95,26.67 110.49,26.67
  pour Top (isolate 0.254, no thermals): 73.66,32.51 71.12,32.51 71.12,27.43 73.66,27.43
  pour Top (isolate 0.254, no thermals): 74.93,27.43 77.47,27.43 77.47,32.51 74.93,32.51
  pour Top (isolate 0.254, no thermals): 40.77,26.04 40.77,31.24 38.35,31.24 38.35,26.04
  pour Route2 (isolate 0.254, rank 6, no thermals): 0,10 0,48.26 15.49,48.26 15.49,35.56 40.64,35.56 40.64,49 51,49 51,57 45,57 45,93.98 45.72,94.16 120,94.16 120,10
  pour Route2 (isolate 0.254, rank 6, no thermals): 0,49 16,49 16,37 16,36 40,36 40,50 50,50 50,56 44,56 44,94.16 0,94.16
  pour Bottom (isolate 0.254): 43.18,85.09 40.64,85.09 40.64,80.01 43.18,80.01
  pour Bottom (isolate 0.254): 11.43,90.17 15.24,90.17 15.24,85.09 11.43,85.09
  pour Route15 (isolate 0.254, rank 5, no thermals): 0,10 22.51,10 22.51,36 11,36 11,48 0,48
LIMIT1  (via drill 0.35)
  Top 0.2: U5.54 60.85,69.74 v60.96,69.85
  Top 0.254: C17.2 v45.59,80.03 R7.2
  Route2 0.254: v47.62,71.25 49.02,69.85 v60.96,69.85
  Route15 0.254: v45.59,80.03 44.82,79.26 44.82,72.01 45.59,71.25 v47.62,71.25
LIMIT2  (via drill 0.35)
  Top 0.152: U6.54 97.68,69.94 v97.69,69.95
  Top 0.254: R8.2 v82.42,80.01 C18.2
  Route2 0.254: v97.69,69.95 96.93,69.19 89.98,69.19 arc-45 88.18,69.93 87.23,70.88 arc45 85.44,71.63 v84.41,71.63
  Route15 0.254: v84.41,71.63 83.19,71.63 82.17,72.64 82.17,79.76 v82.42,80.01
LIMIT3  (via drill 0.35)
  Top 0.2: U7.54 95.36,34.94 v95.38,34.92
  Top 0.254: C19.2 111.25,24.13 | 111.25,24.13 R9.2 | v111.08,24.13 111.25,24.13
  Route15 0.254: v95.38,34.92 107.06,34.92 111.08,30.91 v111.08,24.13
LIMIT4  (via drill 0.35)
  Top 0.2: U8.54 58.53,35.03 v58.52,35.02
  Top 0.254: C20.2 v74.42,24.16 R10.2
  Route2 0.254: v58.52,35.02 59.15,35.66 arc-45 60.45,36.2 65.15,36.2 arc-45 66.45,35.66 68.85,33.26 arc45 70.65,32.51 72.9,32.51 74.52,30.89 v74.52,30.61
  Route15 0.254: v74.52,30.61 74.52,24.26 v74.42,24.16
LINKLED  (via drill 0.35)
  Top 0.254: IC1.25 33.46,59.25 v33.4,59.31
  Top 0.305: v27.69,60.07 27.69,60.48 26.11,62.05 26.11,64.95 24.38,66.67 14.73,66.67 14.35,66.29 v14.35,66.04